# EasyEDA Pro project ProPrj_ESP32-S3.epro, board PCB1_1
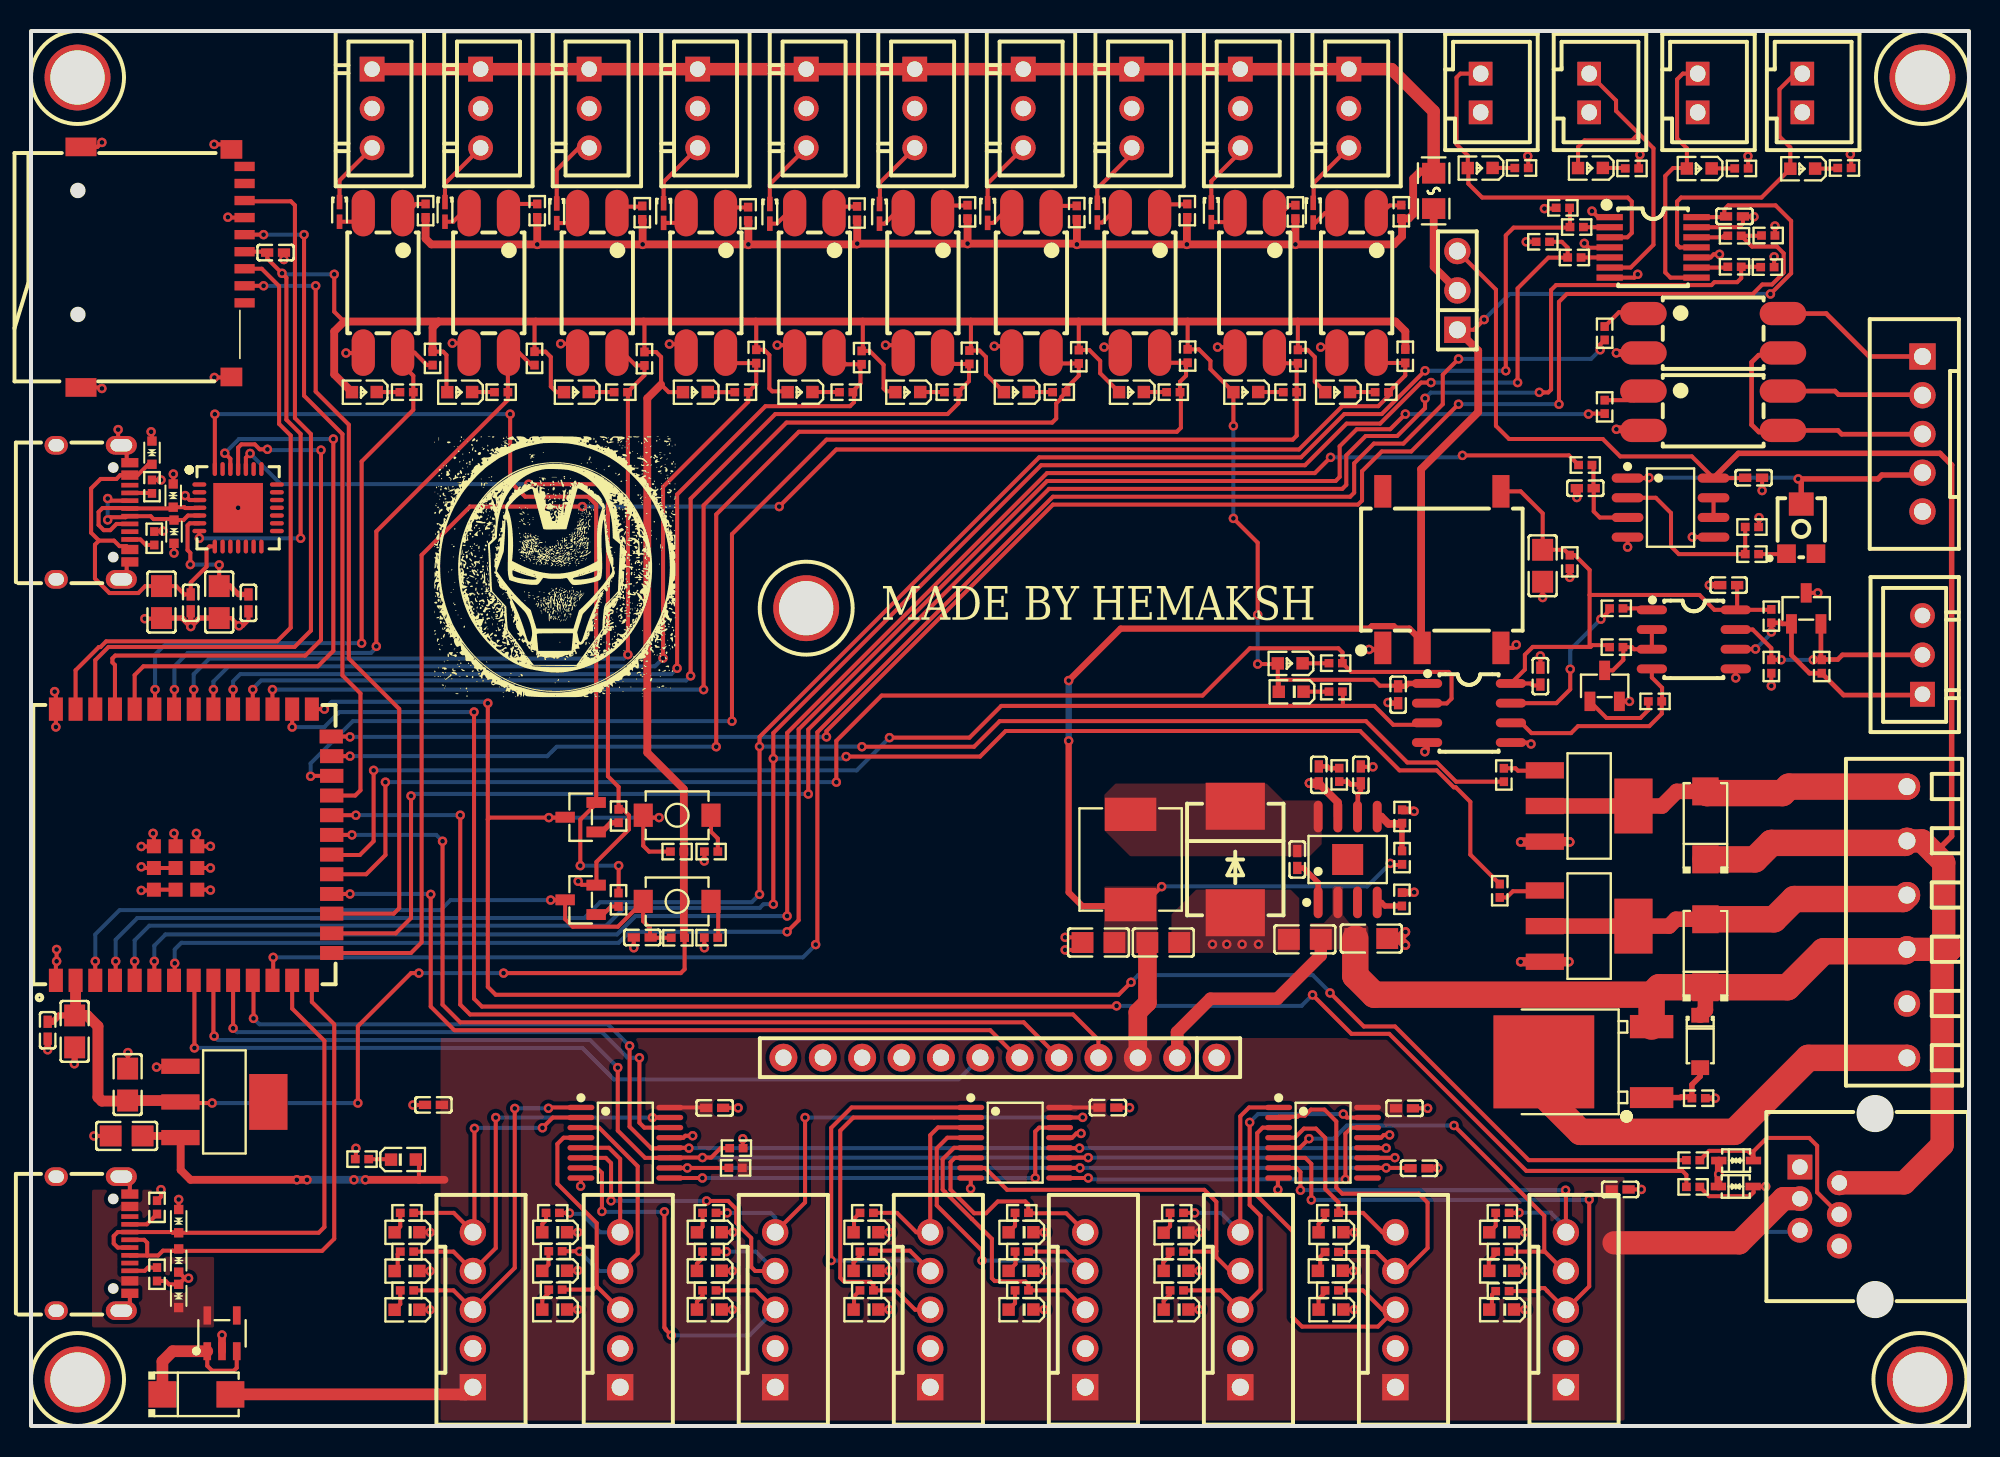
[diagram p3: board, top side]
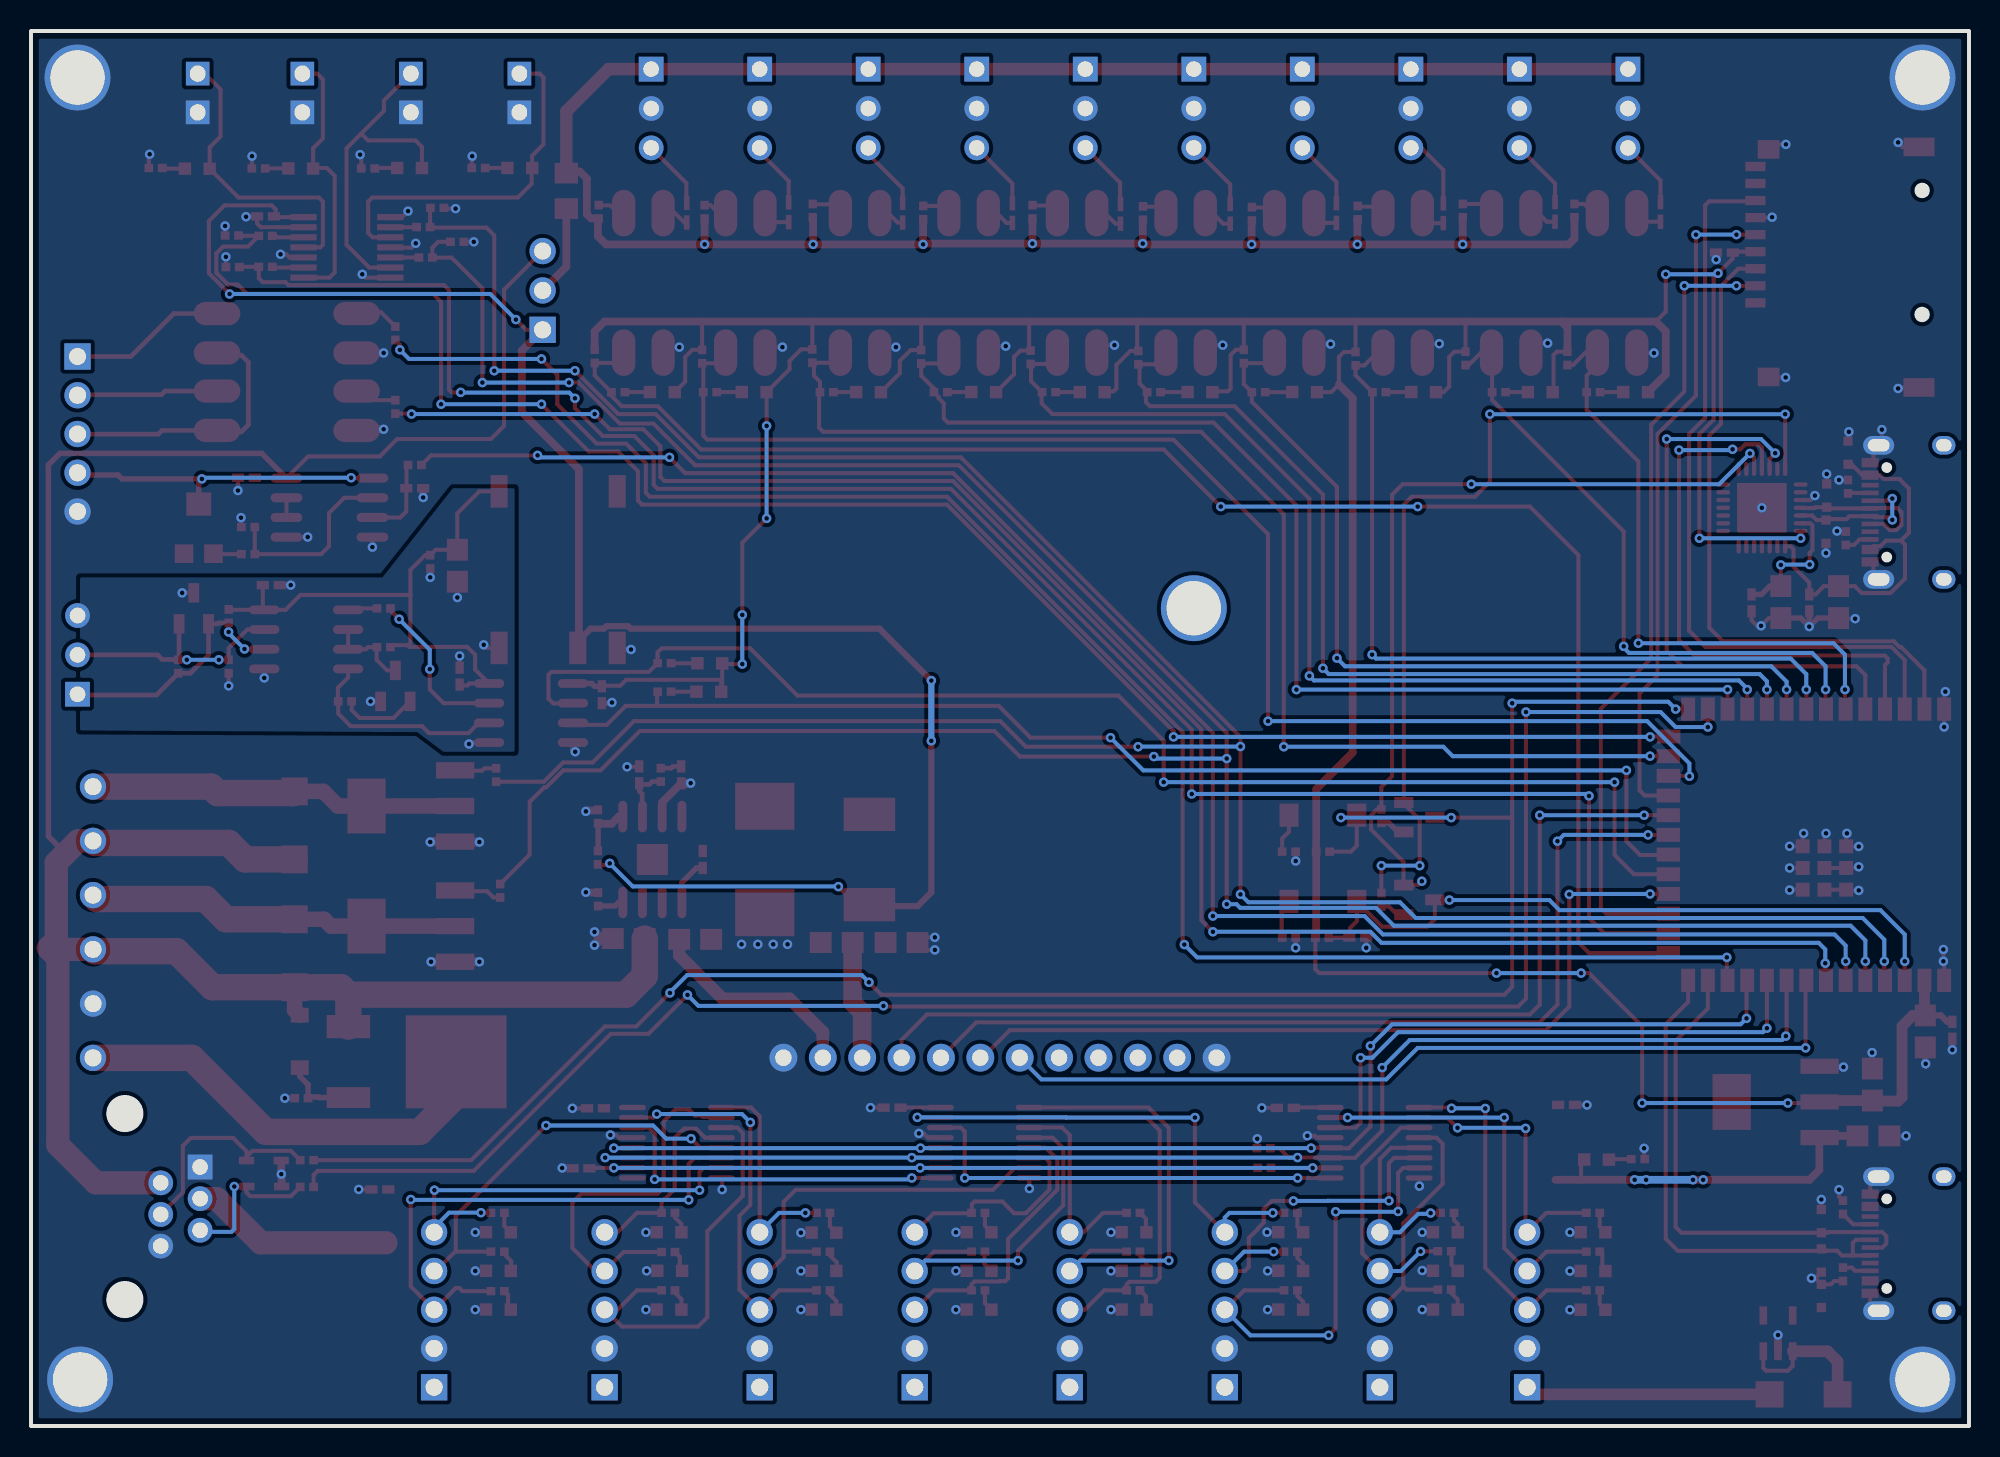
[diagram p4: board, bottom side, seen from below]

Outline 125 x 90 mm; copper layers: Top Layer, Bottom Layer. Coordinates in mm from the lower left corner of the outline.
Outline path: rectangle 0,90 125,0
Stack: Top Layer 0.035mm / Dielectric1 1.51mm FR4 er 4.5 / Bottom Layer 0.035mm

## Design rules (mm)
template: Custom Config
spacing copperThickness1oz (default): track to track 0.102, other pairs 0.152 to 0.3
spacing copperThickness2oz: track to track 0.203, other pairs 0.152 to 0.3
track width copperThickness1oz (default): min 0.127, default 0.254, max 2.54
track width copperThickness2oz: min 0.203, default 0.254, max 2.54
differential pair differentialPair (default): width min 0.127, default 0.254, max 2.54; gap min 0.152, default 0.152
via viaSize (default): diameter min 0.5, default 0.61, max 10; hole min 0.3, default 0.305, max 6.3
net +5V uses copperRegion1
net GND uses copperRegion1
net $1N95227 uses USB
pour e298 uses copperRegion1
pour e2802 uses copperRegion1
pour e2981 uses copperRegion1

## Placement (name value [footprint] x y rotation side)
C1  100nF  [C0402]  81.67 36.55 270 top
C2  2.2uF  [C0805]  86.45 31.45 180 top
C3  2.2uF  [C0805]  82.16 31.4 0 top
C4  47uF  [C0805]  68.85 31.19 0 top
C5  47uF  [C0805]  73.03 31.19 0 top
C6  39pF  [C0402]  85.77 42.01 270 top
C7  6.8nF  [C0402]  83.06 42.01 90 top
C9  10uF  [C0805]  97.5 55.5 90 top
C10  100nF  [C0402]  109.88 78.04 0 top
C11  10uF  [C0805]  6.23 22.03 270 top
C12  10uF  [C0805]  6.17 18.71 0 top
C13  100nF  [C0402]  109.5 54.25 180 top
C14  100nF  [C0402]  97.35 48.38 270 top
C15  100nF  [C0402]  88.18 47.18 90 top
C16  100nF  [C0402]  15.77 75.7 0 top
C17  10uF  [C0805]  2.82 25.46 90 top
C18  100nF  [C0402]  1.08 25.53 270 top
C19  220nF  [C0402]  39.42 31.52 0 top
C21  10uF  [C0805]  12.14 53.16 90 top
C22  100nF  [C0402]  14.02 53.1 270 top
C23  10uF  [C0805]  8.41 53.16 90 top
C24  100nF  [C0402]  10.3 53.1 270 top
C25  100nF  [C0402]  100.25 60.5 0 top
C26  100nF  [C0402]  111.11 61.18 180 top
C27  100nF  [C0402]  44.09 20.52 180 top
C28  100nF  [C0402]  69.46 20.54 180 top
C29  100nF  [C0402]  88.59 20.5 180 top
C30  100nF  [C0402]  89.53 16.62 180 top
C31  100nF  [C0402]  102.5 15.26 0 top
C32  100nF  [C0402]  25.95 20.72 180 top
D1  B560C-13-F  [SMC_L7.1-W6.2-LS8.1-RD]  77.67 36.55 270 top
D2  10V  [SOD-123_L2.8-W1.8-LS3.7-RD]  107.66 24.81 270 top
D3  B340A-13-F  [SMA_L4.4-W2.6-LS5.0-RD]  108 38.75 90 top
D4  B340A-13-F  [SMA_L4.4-W2.6-LS5.0-RD]  108 30.5 90 top
D5  PSM712-ES  [SOT-23-3_L2.9-W1.3-P1.90-LS2.4-BR]  114.5 52.75 270 top
D6  SD03C_C502532  [SOD-323_L1.8-W1.3-LS2.5-BI]  109.96 15.45 0 top
D7  SD03C_C502532  [SOD-323_L1.8-W1.3-LS2.5-BI]  109.98 17.13 0 top
D9  LESD5D5.0CT1G  [SOD-523_L1.2-W0.8-LS1.6-BI]  9.22 57.7 90 top
D10  LESD5D5.0CT1G  [SOD-523_L1.2-W0.8-LS1.6-BI]  9.17 60.03 270 top
D11  LESD5D5.0CT1G  [SOD-523_L1.2-W0.8-LS1.6-BI]  7.8 62.79 270 top
D12  RB521S-30  [SOD-523_L1.2-W0.8-LS1.6-RD]  19.9 78.33 270 top
D13  RB521S-30  [SOD-523_L1.2-W0.8-LS1.6-RD]  26.7 78.33 270 top
D14  RB521S-30  [SOD-523_L1.2-W0.8-LS1.6-RD]  33.91 78.24 270 top
D15  RB521S-30  [SOD-523_L1.2-W0.8-LS1.6-RD]  40.8 78.25 270 top
D16  RB521S-30  [SOD-523_L1.2-W0.8-LS1.6-RD]  47.65 78.2 270 top
D17  RB521S-30  [SOD-523_L1.2-W0.8-LS1.6-RD]  54.73 78.2 270 top
D18  RB521S-30  [SOD-523_L1.2-W0.8-LS1.6-RD]  61.7 78.25 270 top
D19  RB521S-30  [SOD-523_L1.2-W0.8-LS1.6-RD]  68.78 78.28 270 top
D20  RB521S-30  [SOD-523_L1.2-W0.8-LS1.6-RD]  76.13 78.3 270 top
D21  RB521S-30  [SOD-523_L1.2-W0.8-LS1.6-RD]  82.7 78.28 270 top
D22  LESD5D5.0CT1G  [SOD-523_L1.2-W0.8-LS1.6-BI]  9.53 8.39 270 top
D23  LESD5D5.0CT1G  [SOD-523_L1.2-W0.8-LS1.6-BI]  9.53 10.68 90 top
D24  LESD5D5.0CT1G  [SOD-523_L1.2-W0.8-LS1.6-BI]  9.53 13.22 270 top
D25  B340A-13-F  [SMA_L4.4-W2.6-LS5.0-RD]  10.67 2.04 0 top
H3  PZ254V-11-03P  [HDR-TH_3P-P2.54-V-M]  92 73.26 90 top
J1  ZX-XH2.54-2PZZ-R  [CONN-TH_XH2.54-2P]  93.5 86 270 top
J2  ZX-XH2.54-2PZZ-R  [CONN-TH_XH2.54-2P]  100.5 86 270 top
J3  ZX-XH2.54-2PZZ-R  [CONN-TH_XH2.54-2P]  114.25 86 270 top
J4  ZX-XH2.54-2PZZ-R  [CONN-TH_XH2.54-2P]  107.5 86 270 top
J5  ZX-XH2.54-3PZZ  [CONN-TH_3P-P2.54_2501S-3P]  122 49.75 90 top
J6  B5B-XH-A-M(LF)(SN)  [CONN-TH_5P-P2.50_JST_B5B-XH-A-M]  28.5 7.5 270 top
J7  B5B-XH-A-M(LF)(SN)  [CONN-TH_5P-P2.50_JST_B5B-XH-A-M]  122 64 90 top
J8  B5B-XH-A-M(LF)(SN)  [CONN-TH_5P-P2.50_JST_B5B-XH-A-M]  38 7.5 270 top
J9  ZX-XH2.54-3PZZ  [CONN-TH_3P-P2.54_2501S-3P]  22 85 270 top
J10  B5B-XH-A-M(LF)(SN)  [CONN-TH_5P-P2.50_JST_B5B-XH-A-M]  48 7.5 270 top
J11  ZX-XH2.54-3PZZ  [CONN-TH_3P-P2.54_2501S-3P]  29 85 270 top
J12  B5B-XH-A-M(LF)(SN)  [CONN-TH_5P-P2.50_JST_B5B-XH-A-M]  58 7.5 270 top
J13  ZX-XH2.54-3PZZ  [CONN-TH_3P-P2.54_2501S-3P]  36 85 270 top
J14  ZX-XH2.54-3PZZ  [CONN-TH_3P-P2.54_2501S-3P]  43 85 270 top
J15  B5B-XH-A-M(LF)(SN)  [CONN-TH_5P-P2.50_JST_B5B-XH-A-M]  68 7.5 270 top
J16  ZX-XH2.54-3PZZ  [CONN-TH_3P-P2.54_2501S-3P]  50 85 270 top
J17  B5B-XH-A-M(LF)(SN)  [CONN-TH_5P-P2.50_JST_B5B-XH-A-M]  78 7.5 270 top
J18  ZX-XH2.54-3PZZ  [CONN-TH_3P-P2.54_2501S-3P]  57 85 270 top
J19  ZX-XH2.54-3PZZ  [CONN-TH_3P-P2.54_2501S-3P]  64 85 270 top
J20  ZX-XH2.54-3PZZ  [CONN-TH_3P-P2.54_2501S-3P]  71 85 270 top
J21  ZX-XH2.54-3PZZ  [CONN-TH_3P-P2.54_2501S-3P]  78 85 270 top
J22  ZX-XH2.54-3PZZ  [CONN-TH_3P-P2.54_2501S-3P]  85 85 270 top
J23  B5B-XH-A-M(LF)(SN)  [CONN-TH_5P-P2.50_JST_B5B-XH-A-M]  88 7.5 270 top
J24  B5B-XH-A-M(LF)(SN)  [CONN-TH_5P-P2.50_JST_B5B-XH-A-M]  99 7.5 270 top
J67  2685Y-112CNG1SNA01  [HDR-TH_12P-P2.54-V-F]  62.5 23.76 180 top
L1  10uH  [IND-SMD_L7.1-W6.6]  70.92 36.55 270 top
LED2  XL-1608SURC-06  [LED0603-RD_RED]  81.22 49.2 180 top
LED8  XL-1608UGC-04  [LED0603-RD_GREEN]  24.25 12.5 180 top
LED9  XL-1608UGC-04  [LED0603-RD_GREEN]  24.25 10 180 top
LED10  XL-1608UGC-04  [LED0603-RD_GREEN]  24.25 7.5 180 top
LED11  XL-1608SURC-06  [LED0603-RD_RED]  21.5 66.7 180 top
LED12  XL-1608UGC-04  [LED0603-RD_GREEN]  33.78 12.5 180 top
LED13  XL-1608UGC-04  [LED0603-RD_GREEN]  33.78 10.01 180 top
LED14  XL-1608UGC-04  [LED0603-RD_GREEN]  33.78 7.51 180 top
LED15  XL-1608SURC-06  [LED0603-RD_RED]  27.65 66.7 180 top
LED16  XL-1608UGC-04  [LED0603-RD_GREEN]  43.75 12.5 180 top
LED17  XL-1608UGC-04  [LED0603-RD_GREEN]  43.75 10.01 180 top
LED18  XL-1608UGC-04  [LED0603-RD_GREEN]  43.75 7.51 180 top
LED19  XL-1608SURC-06  [LED0603-RD_RED]  35.18 66.7 180 top
LED20  XL-1608SURC-06  [LED0603-RD_RED]  42.85 66.7 180 top
LED21  XL-1608UGC-04  [LED0603-RD_GREEN]  53.85 12.5 180 top
LED22  XL-1608UGC-04  [LED0603-RD_GREEN]  53.85 10.01 180 top
LED23  XL-1608UGC-04  [LED0603-RD_GREEN]  53.85 7.51 180 top
LED24  XL-1608SURC-06  [LED0603-RD_RED]  49.6 66.7 180 top
LED25  XL-1608UGC-04  [LED0603-RD_GREEN]  63.85 12.5 180 top
LED26  XL-1608UGC-04  [LED0603-RD_GREEN]  63.85 10.01 180 top
LED27  XL-1608UGC-04  [LED0603-RD_GREEN]  63.85 7.51 180 top
LED28  XL-1608SURC-06  [LED0603-RD_RED]  56.55 66.7 180 top
LED29  XL-1608UGC-04  [LED0603-RD_GREEN]  73.85 12.48 180 top
LED30  XL-1608UGC-04  [LED0603-RD_GREEN]  73.85 10.01 180 top
LED31  XL-1608UGC-04  [LED0603-RD_GREEN]  73.85 7.51 180 top
LED32  XL-1608SURC-06  [LED0603-RD_RED]  63.55 66.7 180 top
LED33  XL-1608SURC-06  [LED0603-RD_RED]  70.98 66.7 180 top
LED34  XL-1608SURC-06  [LED0603-RD_RED]  78.35 66.7 180 top
LED35  XL-1608SURC-06  [LED0603-RD_RED]  84.28 66.7 180 top
LED36  XL-1608UGC-04  [LED0603-RD_GREEN]  83.85 12.5 180 top
LED37  XL-1608UGC-04  [LED0603-RD_GREEN]  83.8 10.01 180 top
LED38  XL-1608UGC-04  [LED0603-RD_GREEN]  83.85 7.51 180 top
LED39  XL-1608UGC-04  [LED0603-RD_GREEN]  94.85 12.5 180 top
LED40  XL-1608UGC-04  [LED0603-RD_GREEN]  94.85 10.01 180 top
LED41  XL-1608UGC-04  [LED0603-RD_GREEN]  94.85 7.51 180 top
LED42  XL-1608SURC-06  [LED0603-RD_RED]  100.58 81.16 180 top
LED43  XL-1608SURC-06  [LED0603-RD_RED]  107.6 81.13 180 top
LED44  XL-1608SURC-06  [LED0603-RD_RED]  114.28 81.12 180 top
LED45  XL-1608SURC-06  [LED0603-RD_RED]  93.47 81.16 180 top
LED46  XL-1608UGC-04  [LED0603-RD_GREEN]  81.28 47.37 180 top
LED47  XL-1608UGC-04  [LED0603-RD_GREEN]  24.02 17.19 0 top
MH1  Mounting Hole 3.5  [MOUNTING HOLE 3.5]  3 3 0 top
MH2  Mounting Hole 3.5  [MOUNTING HOLE 3.5]  121.84 3 0 top
MH3  Mounting Hole 3.5  [MOUNTING HOLE 3.5]  122 87 0 top
MH4  Mounting Hole 3.5  [MOUNTING HOLE 3.5]  3 87 0 top
MH5  Mounting Hole 3.5  [MOUNTING HOLE 3.5]  50 52.76 180 top
OPT1  TLP521GB-S  [OPTO-SMD-4_L6.5-W4.6-P2.54-LS10.0-TL]  108.5 65.5 0 top
OPT2  TLP521GB-S  [OPTO-SMD-4_L6.5-W4.6-P2.54-LS10.0-TL]  108.5 70.5 0 top
OPT3  TLP521GB-S  [OPTO-SMD-4_L6.5-W4.6-P2.54-LS10.0-TL]  22.7 73.75 270 top
OPT4  TLP521GB-S  [OPTO-SMD-4_L6.5-W4.6-P2.54-LS10.0-TL]  29.53 73.75 270 top
OPT5  TLP521GB-S  [OPTO-SMD-4_L6.5-W4.6-P2.54-LS10.0-TL]  36.53 73.75 270 top
OPT6  TLP521GB-S  [OPTO-SMD-4_L6.5-W4.6-P2.54-LS10.0-TL]  43.53 73.75 270 top
OPT7  TLP521GB-S  [OPTO-SMD-4_L6.5-W4.6-P2.54-LS10.0-TL]  50.53 73.75 270 top
OPT8  TLP521GB-S  [OPTO-SMD-4_L6.5-W4.6-P2.54-LS10.0-TL]  57.53 73.75 270 top
OPT9  TLP521GB-S  [OPTO-SMD-4_L6.5-W4.6-P2.54-LS10.0-TL]  64.53 73.75 270 top
OPT10  TLP521GB-S  [OPTO-SMD-4_L6.5-W4.6-P2.54-LS10.0-TL]  71.53 73.75 270 top
OPT11  TLP521GB-S  [OPTO-SMD-4_L6.5-W4.6-P2.54-LS10.0-TL]  78.93 73.75 270 top
OPT12  TLP521GB-S  [OPTO-SMD-4_L6.5-W4.6-P2.54-LS10.0-TL]  85.5 73.75 270 top
PS1  B0505XT-1WR3S  [PWRM-SMD_B0505XT-1WR3S]  91 55.25 0 top
PTC1  12V 500mA  [F0805]  90.47 79.69 90 top
Q1  AOD407  [TO-252-2_L6.5-W6.1-P4.58-LS10.0-TL]  101.05 23.48 180 top
Q2  NCE6005AR  [SOT-223_L6.5-W3.5-P2.30-LS7.0-BR]  100.5 40 180 top
Q3  NCE6005AR  [SOT-223_L6.5-W3.5-P2.30-LS7.0-BR]  100.5 32.25 180 top
Q4  BSS138  [SOT-23-3_L2.9-W1.3-P1.90-LS2.4-BR]  101.5 47.75 270 top
Q5  MMBT9014C  [SOT-23-3_L2.9-W1.3-P1.90-LS2.4-BR]  35.45 33.95 0 top
Q6  MMBT9014C  [SOT-23-3_L2.9-W1.3-P1.90-LS2.4-BR]  35.45 39.28 0 top
R1  10kΩ  [R0402]  21.35 17.22 0 top
R3  100kΩ  [R0402]  88.42 33.98 270 top
R4  13kΩ  [R0402]  84.38 42.01 270 top
R5  1kΩ  [R0402]  99.69 77.35 0 top
R6  1kΩ  [R0402]  109.88 76.79 0 top
R8  1kΩ  [R0402]  99.55 75.39 0 top
R9  1kΩ  [R0402]  109.88 74.79 0 top
R10  220Ω  [R0402]  99.25 55.75 90 top
R11  1kΩ  [R0402]  95 42 90 top
R12  10kΩ  [R0402]  107.56 21.15 180 top
R13  10kΩ  [R0402]  102.25 50.25 180 top
R15  402Ω  [R0402]  112.25 52.25 90 top
R16  1kΩ  [R0402]  94.74 34.53 270 top
R17  100Ω  [R0402]  102.25 52.75 0 top
R18  120Ω  [R0402]  115.5 49 90 top
R19  1kΩ  [R0402]  104.75 46.75 0 top
R20  402Ω  [R0402]  112.25 49 90 top
R26  120Ω  [R0402]  107.21 15.43 0 top
R27  120Ω  [R0402]  107.21 17.15 0 top
R28  10kΩ  [R0402]  37.89 33.95 270 top
R29  10kΩ  [R0402]  37.9 39.35 270 top
R30  10kΩ  [R0402]  41.72 31.5 0 top
R31  1kΩ  [R0402]  43.86 31.51 0 top
R32  10kΩ  [R0402]  41.67 37.06 0 top
R33  1kΩ  [R0402]  43.87 37.06 0 top
R34  5.1kΩ  [R0402]  7.95 57.27 270 top
R35  5.1kΩ  [R0402]  7.8 60.6 270 top
R36  10kΩ  [R0402]  24.25 13.75 0 top
R37  10kΩ  [R0402]  24.25 11.25 0 top
R38  10kΩ  [R0402]  24.25 8.75 0 top
R39  300Ω  [R0402]  101.5 65.75 90 top
R40  300Ω  [R0402]  101.5 70.5 90 top
R41  10kΩ  [R0402]  33.65 13.75 0 top
R42  10kΩ  [R0402]  33.83 11.28 0 top
R43  10kΩ  [R0402]  33.83 8.8 0 top
R44  10kΩ  [R0402]  24.23 66.7 180 top
R47  4.99kΩ  [R0402]  111 56.25 0 top
R48  10kΩ  [R0402]  100.25 62 0 top
R49  10kΩ  [R0402]  30.33 66.7 180 top
R50  10kΩ  [R0402]  32.48 68.88 90 top
R51  10kΩ  [R0402]  43.75 13.75 0 top
R52  10kΩ  [R0402]  43.75 11.25 0 top
R53  10kΩ  [R0402]  43.75 8.75 0 top
R54  10kΩ  [R0402]  111 58 180 top
R56  10kΩ  [R0402]  38.04 66.7 180 top
R57  10kΩ  [R0402]  39.57 68.86 90 top
R59  10kΩ  [R0402]  53.9 13.75 0 top
R60  10kΩ  [R0402]  53.9 11.25 0 top
R61  10kΩ  [R0402]  53.9 8.75 0 top
R62  10kΩ  [R0402]  45.83 66.7 180 top
R63  10kΩ  [R0402]  46.78 69 90 top
R65  10kΩ  [R0402]  52.58 66.7 180 top
R66  10kΩ  [R0402]  63.9 13.75 0 top
R67  10kΩ  [R0402]  63.9 11.25 0 top
R68  10kΩ  [R0402]  63.9 8.75 0 top
R69  10kΩ  [R0402]  53.58 68.93 90 top
R71  10kΩ  [R0402]  45.5 17.93 180 top
R72  10kΩ  [R0402]  59.35 66.7 180 top
R73  10kΩ  [R0402]  60.52 68.95 90 top
R75  10kΩ  [R0402]  73.9 13.75 0 top
R76  10kΩ  [R0402]  73.9 11.25 0 top
R77  10kΩ  [R0402]  73.9 8.75 0 top
R78  10kΩ  [R0402]  66.33 66.7 180 top
R79  10kΩ  [R0402]  67.58 68.98 90 top
R81  10kΩ  [R0402]  73.68 66.7 180 top
R82  10kΩ  [R0402]  74.6 69.03 90 top
R84  10kΩ  [R0402]  45.45 16.65 0 top
R85  680Ω  [R0402]  25.45 78.41 90 top
R86  680Ω  [R0402]  32.65 78.41 90 top
R87  680Ω  [R0402]  39.43 78.28 90 top
R88  680Ω  [R0402]  46.25 78.2 90 top
R89  680Ω  [R0402]  53.28 78.25 90 top
R90  680Ω  [R0402]  60.4 78.33 90 top
R91  680Ω  [R0402]  67.45 78.28 90 top
R92  680Ω  [R0402]  74.58 78.41 90 top
R93  10kΩ  [R0402]  81.71 69 90 top
R94  10kΩ  [R0402]  81.2 66.7 180 top
R95  10kΩ  [R0402]  88.64 69.02 90 top
R96  10kΩ  [R0402]  87.13 66.7 180 top
R97  680Ω  [R0402]  81.55 78.33 90 top
R98  680Ω  [R0402]  88.38 78.34 90 top
R99  10kΩ  [R0402]  83.9 13.75 0 top
R100  10kΩ  [R0402]  83.9 11.23 0 top
R101  10kΩ  [R0402]  83.9 8.75 0 top
R102  10kΩ  [R0402]  94.9 13.75 0 top
R103  10kΩ  [R0402]  94.9 11.25 0 top
R104  10kΩ  [R0402]  94.9 8.7 0 top
R105  5.1kΩ  [R0402]  8.13 9.79 90 top
R106  5.1kΩ  [R0402]  8.13 14.11 270 top
R107  10kΩ  [R0402]  25.9 68.88 90 top
R110  10kΩ  [R0402]  103.26 81.13 0 top
R111  10kΩ  [R0402]  110.32 81.13 0 top
R112  10kΩ  [R0402]  116.97 81.16 0 top
R113  10kΩ  [R0402]  96.14 81.16 0 top
R114  5.1kΩ  [R0402]  84.15 49.22 180 top
R115  5.1kΩ  [R0402]  84.15 47.38 180 top
R116  10kΩ  [R0402]  112.05 76.81 180 top
R117  10kΩ  [R0402]  112 74.77 180 top
R118  10kΩ  [R0402]  97.51 76.4 0 top
R119  10kΩ  [R0402]  98.8 78.59 0 top
R120  10kΩ  [R0402]  88.44 39.32 270 top
R121  53.6kΩ  [R0402]  88.44 36.67 270 top
RJ1  RJ1  [RJ11-TH_PCB-6P6C-90]  115.36 14.16 90 top
SD1  TF-01A  [TF-SMD_TF-01A]  8.5 74.76 270 top
SW1  SKRKAEE020  [KEY-SMD_L3.9-W3.0-LS5.0]  41.67 33.84 180 top
SW2  SKRKAEE020  [KEY-SMD_L3.9-W3.0-LS5.0]  41.67 39.4 180 top
TB1  DB125-3.5-6P-GN-S  [CONN-TH_6P-P3.50_DB125-3.5-6P-GN-S]  121 32.5 90 top
U1  TPS54360DDAR  [SOIC-8_L5.0-W4.0-P1.27-LS6.0-BL-EP2.0]  84.92 36.55 0 top
U2  74AHCT125T14-13  [TSSOP-14_L5.0-W4.4-P0.65-LS6.4-BL]  104.62 76.04 270 top
U3  AMS1117-3.3_C369933  [SOT-223-4_L6.5-W3.5-P2.30-LS7.0-BR]  12.47 20.91 180 top
U4  ADUM3201ARZ-RL7  [SOIC-8_L5.0-W4.0-P1.27-LS6.0-BL]  92.75 46 270 top
U5  SN65HVD3082EDR  [SOIC-8_L5.0-W4.0-P1.27-LS6.0-BL]  107.25 50.75 270 top
U7  CP2102-GMR  [WQFN-28_L5.0-W5.0-P0.50-BL-EP3.2]  13.36 59.24 270 top
U8  LM358ADT  [SOIC-8_L4.9-W3.9-P1.27-LS6.0-BL]  105.75 59.25 270 top
U9  74AHCT595T16-13  [TSSOP-16_L5.0-W4.4-P0.65-LS6.4-BL]  38.34 18.28 270 top
U10  74AHCT595T16-13  [TSSOP-16_L5.0-W4.4-P0.65-LS6.4-BL]  63.48 18.28 270 top
U11  74AHCT595T16-13  [TSSOP-16_L5.0-W4.4-P0.65-LS6.4-BL]  83.34 18.28 270 top
U13  MIC2005A-1YM5-TR  [SOT-23-5_L3.0-W1.7-P0.95-LS2.8-BL]  12.32 5.98 0 top
U14  ESP32-S3-WROOM-1U-N8R8  [WIRELM-SMD_ESP32-S3-WROOM-1U]  10.5 37.5 90 top
USB1  TYPE-C 16PIN 2MD(073)  [USB-C-SMD_TYPE-C-6PIN-2MD-073]  4 58.95 270 top
USB2  TYPE-C 16PIN 2MD(073)  [USB-C-SMD_TYPE-C-6PIN-2MD-073]  4 11.76 270 top
VR1  20kΩ  [RES-ADJ-SMD_TC33X-2-104E]  114.18 57.88 0 top

## Footprints (pads in the part's own frame, mm; a bottom-side part is the same pattern mirrored in y, then rotated)
C0402
  rect 0.79x0.54 smd: 1(-0.545,0) 2(0.545,0)
C0805
  rect 1.41x1.35 smd: 1(-1.03,0) 2(1.03,0)
CONN-TH_3P-P2.54_2501S-3P
  rect 1.6x1.6 hole 1: 1(-2.54,0)
  round 1.6 hole 1: 2(0,0) 3(2.54,0)
CONN-TH_5P-P2.50_JST_B5B-XH-A-M
  rect 1.7x1.7 hole 1.1: 1(5,0)
  round 1.7 hole 1.1: 2(2.5,0) 3(0,0) 4(-2.5,0) 5(-5,0)
CONN-TH_6P-P3.50_DB125-3.5-6P-GN-S
  round 1.7 hole 1.1: 1(-8.75,0) 2(-5.25,0) 3(-1.75,0) 4(1.75,0) 5(5.25,0) 6(8.75,0)
CONN-TH_XH2.54-2P
  rect 1.524x1.524 hole 1.05x1: 1(-1.25,0) 2(1.25,0)
F0805
  rect 1.335x1.5 smd: 1(-1.143,0) 2(1.143,0)
HDR-TH_3P-P2.54-V-M
  rect 1.7x1.7 hole 1.1: 1(-2.54,0)
  round 1.7 hole 1.1: 2(0,0) 3(2.54,0)
HDR-TH_12P-P2.54-V-F
  round 1.8 hole 1.05: 1(-13.97,0) 2(-11.43,0) 3(-8.89,0) 4(-6.35,0) 5(-3.81,0) 6(-1.27,0) 7(1.27,0) 8(3.81,0) 9(6.35,0) 10(8.89,0) 11(11.43,0) 12(13.97,0)
IND-SMD_L7.1-W6.6
  rect 2.15x3.32 smd: 1(-2.913,0) 2(2.913,0)
KEY-SMD_L3.9-W3.0-LS5.0
  rect 1.23x1.5 smd: 1(-2.185,0) 2(2.185,0)
LED0603-RD_GREEN
  rect 0.8x0.8 smd: 1(-0.799,-0.004) 2(0.799,0.004)
LED0603-RD_RED
  rect 0.8x0.8 smd: 1(-0.799,-0.004) 2(0.799,0.004)
MOUNTING HOLE 3.5
  round 4.25 hole 3.5: 1(0,0)
OPTO-SMD-4_L6.5-W4.6-P2.54-LS10.0-TL
  oval 3x1.5 smd: 1(-4.5,1.27) 2(-4.5,-1.27) 3(4.5,-1.27) 4(4.5,1.27)
PWRM-SMD_B0505XT-1WR3S
  rect 1.1x2.1 smd: 1(-3.81,-5.05) 2(-1.27,-5.05) 4(3.81,-5.05) 5(3.81,5.05) 8(-3.81,5.05)
R0402
  rect 0.566x0.54 smd: 1(-0.432,0) 2(0.433,0)
RES-ADJ-SMD_TC33X-2-104E
  rect 1.2x1.2 smd: 1(-0.95,-1.6) 3(0.95,-1.6)
  rect 1.6x1.5 smd: 2(0,1.6)
RJ11-TH_PCB-6P6C-90
  rect 1.6x1.6 hole 1: 1(2.55,1.27)
  round 1.6 hole 1: 2(1.53,-1.27) 3(0.51,1.27) 4(-0.51,-1.27) 5(-1.53,1.27) 6(-2.55,-1.27)
SMA_L4.4-W2.6-LS5.0-RD
  rect 1.8x1.7 smd: 1(-2.192,0) 2(2.192,0)
SMC_L7.1-W6.2-LS8.1-RD
  rect 3.03x3.82 smd: 1(-3.435,0) 2(3.435,0)
SOD-123_L2.8-W1.8-LS3.7-RD
  rect 0.95x1.15 smd: 1(-1.692,0) 2(1.692,0)
SOD-323_L1.8-W1.3-LS2.5-BI
  rect 0.985x0.49 smd: 1(-1.117,0) 2(1.117,0)
SOD-523_L1.2-W0.8-LS1.6-BI
  rect 0.6x0.6 smd: 1(-0.75,0) 2(0.75,0)
SOD-523_L1.2-W0.8-LS1.6-RD
  rect 0.93x0.36 smd: 1(-0.635,0) 2(0.635,0)
SOIC-8_L4.9-W3.9-P1.27-LS6.0-BL
  oval 0.588x2.045 smd: 1(-1.905,-2.772) 2(-0.635,-2.772) 3(0.635,-2.772) 4(1.905,-2.772) 5(1.905,2.772) 6(0.635,2.772) 7(-0.635,2.772) 8(-1.905,2.772)
SOIC-8_L5.0-W4.0-P1.27-LS6.0-BL
  oval 0.569x1.95 smd: 1(-1.905,-2.705) 2(-0.635,-2.705) 3(0.635,-2.705) 4(1.905,-2.705) 5(1.905,2.705) 6(0.635,2.705) 7(-0.635,2.705) 8(-1.905,2.705)
SOIC-8_L5.0-W4.0-P1.27-LS6.0-BL-EP2.0
  oval 0.574x2.038 smd: 1(-1.905,-2.769) 2(-0.635,-2.769) 3(0.635,-2.769) 4(1.905,-2.769) 5(1.905,2.769) 6(0.635,2.769) 7(-0.635,2.769) 8(-1.905,2.769)
  rect 2x2 smd: 9(0,0)
SOT-23-3_L2.9-W1.3-P1.90-LS2.4-BR
  rect 1.25x0.7 smd: 1(1,-0.95) 2(1,0.95) 3(-1,0)
SOT-23-5_L3.0-W1.7-P0.95-LS2.8-BL
  rect 0.49x1.157 smd: 1(-0.95,-1.153) 2(0,-1.153) 3(0.95,-1.153)
  rect 0.49x1.175 smd: 4(0.95,1.153) 5(-0.95,1.153)
SOT-223-4_L6.5-W3.5-P2.30-LS7.0-BR
  rect 2.47x0.98 smd: 1(2.835,-2.3) 2(2.835,0) 3(2.835,2.3)
  rect 2.47x3.6 smd: 4(-2.835,0)
SOT-223_L6.5-W3.5-P2.30-LS7.0-BR
  rect 2.465x1.05 smd: 1(2.857,-2.3) 2(2.857,0) 3(2.857,2.3)
  rect 2.465x3.54 smd: 4(-2.857,0)
TF-SMD_TF-01A
  rect 0.6x1.3 smd: 1(2.3,5.276) 2(1.2,5.276) 3(0.101,5.276) 4(-1,5.276) 5(-2.099,5.276) 6(-3.2,5.276) 7(-4.3,5.276) 8(-5.399,5.276) 9(-6.5,5.276)
  rect 1.2x1.4 smd: 10(-7.599,4.426) 13(7.08,4.426)
  rect 1.2x2 smd: 11(-7.76,-5.276) 12(7.76,-5.276)
TO-252-2_L6.5-W6.1-P4.58-LS10.0-TL
  rect 2.8x1.35 smd: 1(-3.475,2.29)
  rect 2.8x1.5 smd: 3(-3.475,-2.29)
  rect 6.5x6 smd: 4(3.475,-0.017)
TSSOP-14_L5.0-W4.4-P0.65-LS6.4-BL
  rect 0.4x1.7 smd: 1(-1.95,-2.8) 2(-1.3,-2.8) 3(-0.65,-2.8) 4(0,-2.8) 5(0.65,-2.8) 6(1.3,-2.8) 7(1.95,-2.8) 8(1.95,2.8) 9(1.3,2.8) 10(0.65,2.8) 11(0,2.8) 12(-0.65,2.8) 13(-1.3,2.8) 14(-1.95,2.8)
TSSOP-16_L5.0-W4.4-P0.65-LS6.4-BL
  oval 0.343x1.732 smd: 1(-2.275,-2.865) 2(-1.625,-2.865) 3(-0.975,-2.865) 4(-0.325,-2.865) 5(0.325,-2.865) 6(0.975,-2.865) 7(1.625,-2.865) 8(2.275,-2.865) 9(2.275,2.866) 10(1.625,2.866) 11(0.975,2.866) 12(0.325,2.866) 13(-0.325,2.866) 14(-0.975,2.866) 15(-1.625,2.866) 16(-2.275,2.866)
USB-C-SMD_TYPE-C-6PIN-2MD-073
  rect 0.6x1.1 smd: 1(-3.2,2.375) 2(-2.4,2.375) 11(2.4,2.375) 12(3.2,2.375)
  rect 0.3x1.1 smd: 3(-1.75,2.375) 4(-1.25,2.375) 5(-0.75,2.375) 6(-0.25,2.375) 7(0.25,2.375) 8(0.75,2.375) 9(1.25,2.375) 10(1.75,2.375)
  oval 1.2x2 hole 0.8x1.4: 13(-4.325,1.825) 14(4.325,1.825)
  oval 1.2x1.5 hole 0.8x1: 15(-4.325,-2.375) 16(4.325,-2.375)
WIRELM-SMD_ESP32-S3-WROOM-1U
  rect 1.5x0.9 smd: 1(-8.75,8.895) 2(-8.75,7.625) 3(-8.75,6.355) 4(-8.75,5.085) 5(-8.75,3.815) 6(-8.75,2.545) 7(-8.75,1.275) 8(-8.75,0.005) 9(-8.75,-1.265) 10(-8.75,-2.535) 11(-8.75,-3.805) 12(-8.75,-5.075) 13(-8.75,-6.345) 14(-8.75,-7.615) 27(8.75,-7.615) 28(8.75,-6.345) 29(8.75,-5.075) 30(8.75,-3.805) 31(8.75,-2.535) 32(8.75,-1.265) 33(8.75,0.005) 34(8.75,1.275) 35(8.75,2.545) 36(8.75,3.815) 37(8.75,5.085) 38(8.75,6.355) 39(8.75,7.625) 40(8.75,8.895)
  rect 0.9x1.5 smd: 15(-6.985,-8.895) 16(-5.715,-8.895) 17(-4.445,-8.895) 18(-3.175,-8.895) 19(-1.905,-8.895) 20(-0.635,-8.895) 21(0.635,-8.895) 22(1.905,-8.895) 23(3.175,-8.895) 24(4.445,-8.895) 25(5.715,-8.895) 26(6.985,-8.865)
  rect 0.9x0.9 smd: 41(-2.9,2.575) 41(-2.9,1.175) 41(-2.9,-0.225) 41(-1.5,2.575) 41(-1.5,1.175) 41(-1.5,-0.225) 41(-0.1,2.575) 41(-0.1,1.175) 41(-0.1,-0.225)
WQFN-28_L5.0-W5.0-P0.50-BL-EP3.2
  oval 0.28x0.9 smd: 1(-1.502,-2.5) 2(-1.001,-2.5) 3(-0.5,-2.5) 4(0,-2.5) 5(0.5,-2.5) 6(1,-2.5) 7(1.501,-2.5) 15(1.501,2.5) 16(1,2.5) 17(0.5,2.5) 18(0,2.5) 19(-0.5,2.5) 20(-1.001,2.5) 21(-1.502,2.5)
  oval 0.9x0.28 smd: 8(2.5,-1.502) 9(2.5,-1.001) 10(2.5,-0.5) 11(2.5,0) 12(2.5,0.5) 13(2.5,1) 14(2.5,1.501) 22(-2.5,1.501) 23(-2.5,1) 24(-2.5,0.5) 25(-2.5,0) 26(-2.5,-0.5) 27(-2.5,-1.001) 28(-2.5,-1.502)
  rect 3.2x3.2 smd: 29(0,0)

## Nets
As in the schematic.

Pads without a net: J67 8 9 10 11; MH5 1; PS1 8; SD1 1 8 9; U1 3; U3 4; U7 1 2 9 10 11 12 13 14 15 16 17 18 19 20 21 22 23 27; U11 9; U13 4; USB1 3 9 15 16; USB2 3 9 15 16; VR1 3

## Via types
v1: diameter 0.61, hole 0.305, Top Layer to Bottom Layer, 322 vias

## Routing (per net, layer and track width the routed paths; a pad name or vN(x,y) marks a point on that pad's centre or on a via; arc(x,y) is an arc through that point)
+3V3: length 290
  Top Layer w0.26: 60.62,71.26 60.62,69.48 R73.2 61.18,69.38 61.59,68.97 61.59,67.86 LED32.2 ; 53.65,71.26 53.65,69.44 R69.2 54.09,69.36 54.99,68.46 54.99,66.94 55.18,66.75 55.7,66.75 LED28.2 ; v1(17.39,57.27) 17.39,64.01 16.47,64.92 16.47,74.09 v1(16.19,74.37) 15.24,75.32 15.24,75.69 C16.1 ; v1(25.02,29.22) 24.51,29.22 21.08,25.79 v1(21.08,20.84) ; 10.86,57.74 v1(10.86,57.27) ; v1(30.48,29.22) 41.91,29.22 42.16,29.47 R30.2 ; LED20.2 41.13,66.7 40.64,67.19 40.64,68.97 40.32,69.29 39.57,69.29 39.57,71.2 39.51,71.26 ; LED24.2 48.75,66.75 47.81,66.75 47.62,66.94 47.62,69.1 47.28,69.44 R63.2 46.78,71.23 46.75,71.26 ; v1(77.55,58.56) 79.12,56.99 v1(79.12,52.33) ; v1(77.55,64.52) LED34.2 76.07,68.18 76.07,68.72 75.33,69.46 R82.2 74.6,71.24 74.62,71.26 ; 32.55,71.26 32.48,71.18 R50.2 33.19,69.31 33.53,68.97 33.53,67.06 33.89,66.7 34.38,66.7 ; 67.57,71.26 67.58,71.24 R79.2 68.26,69.42 68.96,68.72 68.96,67.92 LED33.2 ; SD1.4 15.23,75.76 ; LED15.2 26.8,66.75 26.8,69.1 26.58,69.31 R107.2 ; 81.71,71.25 R93.2 82.34,69.43 82.8,68.97 82.8,67.38 LED35.2 ; v1(11.68,20.84) 9.71,20.84 ; C15.2 88.14,47.76 87,47.76 86.61,48.14 80.48,48.14 80.48,47.38 80.42,47.44 LED2.2 80.37,49.16 v1(79.12,49.16) ; 20.19,71.26 19.56,71.89 v1(19.56,74.3)
  Top Layer w0.35: U4.1 88.83,47.91 88.65,47.72 C15.2
  Top Layer w0.4: C18.1 1.41,26.08 1.81,26.49 C17.2
  Top Layer w0.5: R107.2 25.9,70.87 26.29,71.26 ; 20.7,66.7 19.56,67.84 19.56,70.62 20.19,71.26 26.29,71.26 ; 26.29,71.26 88.01,71.26 88.65,70.62 88.65,69.46 R95.2 ; 40.64,67.19 39.75,66.3 39.75,43.44 42.11,41.09 R32.2 42.11,31.55 R30.2
  Top Layer w0.7: U3.2 9.55,21 C11.2 6.2,20.96 4.57,20.96 4.32,21.22 4.32,25.79 3.62,26.49 C17.2 2.88,26.55 U14.2
  Bottom Layer w0.26: v1(19.56,74.3) 16.26,74.3 v1(16.19,74.37) ; v1(30.48,29.22) v1(25.02,29.22) ; v1(77.55,64.52) v1(77.55,58.56) ; v1(21.08,20.84) v1(11.68,20.84) ; v1(10.86,57.27) v1(17.39,57.27) ; v1(79.12,52.33) v1(79.12,49.16)
+5V: length 182.4
  Top Layer w0.26: U10.16 68.91,20.55 C28.2 ; v1(112.19,73.03) 113.53,74.37 113.53,77.74 112.52,78.75 109.47,78.75 109.22,78.49 109.22,78.15 C10.1 109.28,77.99 U2.14 ; v1(93.73,71.38) 93.07,70.72 H3.1 ; 89.66,50.81 89.73,50.74 PS1.2 ; C27.2 43.52,20.55 41.2,20.55 ; 25.02,15.88 25.02,17.03 24.83,17.22 ; 88.42,36.2 87.78,36.2 v1(87.67,36.3) ; v1(72.92,34.8) 71.76,33.64 L1.2
  Top Layer w0.4: v1(66.93,48.09) 70.28,51.44 86.34,51.44 86.49,51.6 87.89,51.6 88.04,51.44 88.9,51.44 89.53,50.81 89.66,50.81 ; v1(66.93,44.2) 66.93,34.43 67.82,33.54 70.83,33.54 L1.2
  Top Layer w0.5: 26.67,15.88 v1(21.57,15.88) ; v1(17.8,15.88) v1(17.14,15.88) 10.29,15.88 9.65,16.52 9.65,18.59 U3.3 9.53,18.71 C12.2 ; 89.66,50.81 89.66,61.73 93.34,65.41 93.34,69.38 H3.1
  Top Layer w0.75: J6.1 28.04,2.04 D25.2
  Top Layer w1.2: C5.1 72.01,31.19 72.01,27.31 71.39,26.69 J67.3
  Top Layer w1.5: RJ1.3 113.03,14.67 110.18,11.82 102.11,11.82
  Bottom Layer w0.26: v1(72.92,34.8) 72.94,34.81 86.19,34.81 v1(87.67,36.3) ; v1(112.19,73.03) 95.38,73.03 v1(93.73,71.38)
  Bottom Layer w0.4: v1(66.93,48.09) v1(66.93,44.2)
  Bottom Layer w0.5: v1(17.8,15.88) v1(20.83,15.88) v1(21.57,15.88)
+5V_ISO: length 37.8
  Top Layer w0.26: 112.25,52.68 112.22,52.66 U5.8 ; U5.8 108.58,52.66 107.62,53.62 100.53,53.62 ; U5.8 110.04,52.75 C13.1 ; 100.53,53.62 100.53,50.38 ; 100.53,53.62 100.53,55.23 99.57,56.18 99.25,56.18 98.9,56.53 C9.2 97.5,56.53 97.5,58.88 96.08,60.3 PS1.5 ; R13.2 101.69,50.38 100.71,50.38 100.59,50.26 96.86,50.26 96.35,49.76 96.35,48.81 U4.8 96.73,47.91 96.85,47.78 97.3,47.78 97.35,47.83
+12V: length 175.1
  Top Layer w0.26: 122.77,36.94 122.63,36.8 ; H3.3 94.49,73.31 94.49,64.52 95.33,63.68 101.38,63.68 102.5,62.55 107.12,62.55 U8.8 110.54,61.16 C26.2
  Top Layer w0.35: 122.77,36.94 123.88,38.05 123.88,62 123.13,62.75 110.12,62.75 U8.8
  Top Layer w0.8: C3.2 83.19,30.37 80.39,27.57 76.07,27.57 73.91,25.41 73.91,25.15 73.93,25.13 J67.2
  Top Layer w1: D4.1 108,26.84 107.66,26.5
  Top Layer w1.5: 123.8,30.75 123.88,30.83 123.37,31.34 123.37,36.34 121.96,37.75 TB1.5 ; 123.8,30.75 TB1.3 ; 123.8,30.75 123.27,30.22 123.27,18.14 120.82,15.69 RJ1.2
  Top Layer w1.7: 104.53,27.82 Q1.3 ; 104.53,27.82 86.63,27.82 85.42,29.04 C2.2 ; 104.53,27.82 105.01,28.31 D4.1 113.29,28.31 115.62,30.63 120.88,30.63 TB1.3 ; TB1.5 120.87,37.62 112.25,37.62 111.19,36.56 D3.1
GND: length 141.6
  Top Layer w0.26: v1(117.35,82.05) 117.4,82 R112.2 ; v1(6.25,24.09) 6.25,23.08 C11.1 ; v1(100.19,76.3) 100.47,76.02 101.8,76.02 U2.4 ; C21.1 12.91,52.13 v1(13.41,51.63) 13.67,51.63 14.02,51.98 C22.2 ; R33.1 43.43,36.46 v1(43.43,36.45) ; U9.8 35.47,15.49 v1(35.45,15.48) ; v1(25.74,10) 25.73,10 LED9.1 ; U11.8 80.42,15.95 v1(80.42,15.25) ; 6.17,62.15 6.17,62.72 5.62,63.27 v1(5.62,64.28) ; 12.93,82.36 12.6,82.69 v1(11.81,82.69) ; v1(55.12,69.73) 55.78,69.73 OPT8.3 ; v1(66.7,30.72) 67.34,30.72 C4.1 67.49,31.53 v1(66.7,31.53) ; v1(4.57,66.94) 4.51,67 SD1.12 ; v1(12.7,77.99) 12.72,77.96 SD1.6 ; LED23.1 55.34,7.51 v1(55.34,7.51) ; v1(67.73,18.88) 67.43,18.88 67.15,18.6 U10.13 ; v1(76.53,69.6) 77.3,69.6 OPT11.3 ; v1(69.22,69.6) 69.9,69.6 OPT10.3 ; LED12.1 35.26,12.5 v1(35.27,12.5) ; v1(25.74,7.49) 25.73,7.5 LED10.1 ; USB2.12 6.38,7.99 5.83,7.44 ; v1(103.77,82.02) 103.7,81.94 R110.2 ; v1(75.34,10.01) 75.34,10.01 LED30.1 ; U14.41 U14.41 7.88,34.55 v1(7.11,34.55) ; v1(55.34,10.01) 55.34,10.01 LED22.1 ; USB2.13 6.38,15.54 USB2.1 ; LED26.1 65.34,10.01 v1(65.34,10.01) ; C32.2 25.4,20.71 v1(24.64,20.71) ; 5.62,54.62 6.17,55.17 6.17,55.75 ; U2.10 108.33,75.39 108.53,75.59 v1(108.91,75.59) ; U2.1 101.07,77.99 v1(100.68,78.38) ; 8.13,9.35 8.69,9.35 8.9,9.14 D22.1 9.92,9.53 ; v1(87.63,18.78) 87.25,18.78 87.08,18.6 86.21,18.6 ; R118.1 v1(96.44,76.4) ; R1.1 20.95,17.26 v1(20.95,17.92) ; LED39.1 96.34,12.5 v1(96.34,12.5) ; R34.1 7.98,57.74 v1(8.51,57.74) ; v1(1.61,45.1) U14.40 1.61,47.3 v1(1.52,47.38) ; v1(62.13,69.67) 62.84,69.67 OPT9.3 ; OPT7.3 48.78,69.73 v1(48.13,69.73) ; LED41.1 96.34,7.51 v1(96.34,7.51) ; v1(111.66,60.35) 111.66,61.17 C26.1 ; v1(83.19,69.6) 83.88,69.6 OPT12.3 ; v1(75.34,7.51) 75.33,7.51 LED31.1 ; v1(41.18,69.8) 41.7,69.8 OPT6.3 ; v1(90.74,16.65) 90.72,16.62 C30.1 ; v1(65.34,7.51) 65.34,7.51 LED27.1 ; v1(97.62,78.54) 98.32,78.54 R119.1 ; D9.1 v1(9.22,56.32) ; LED25.1 65.34,12.5 v1(65.34,12.5) ; v1(34.17,69.82) 34.68,69.82 OPT5.3 ; LED17.1 45.23,10.01 v1(45.24,10.01) ; U8.5 108.51,57.35 v1(107.16,57.35) ; C23.1 8.37,52.08 v1(7.34,52.08) ; C28.1 70.85,20.54 ; v1(45.91,18.53) 45.91,17.95 R71.1 ; v1(96.34,10.01) 96.34,10.01 LED40.1 ; U14.41 11.55,34.6 v1(11.57,34.57) ; C31.2 v1(103.86,15.26) ; R54.1 111.46,58.02 v1(111.46,58.6) ; v1(11.83,67.65) 12.89,67.65 SD1.13 ; v1(7.11,36.08) 7.19,36 U14.41 U14.41 ; v1(35.27,7.51) 35.26,7.51 LED14.1 ; v1(8.38,15.25) 8.38,14.79 R106.1 ; C16.2 16.31,75.69 v1(16.31,75.26) ; D11.1 7.8,64.09 v1(7.75,64.14) ; v1(42.68,18.73) 42.2,18.73 42.08,18.6 41.2,18.6 ; v1(45.24,7.51) 45.23,7.51 LED18.1 ; v1(7.11,37.39) 7.91,37.39 U14.41 7.92,38.18 v1(7.87,38.24) ; v1(38.88,30.85) 38.88,31.45 38.83,31.5 ; LED36.1 85.33,12.5 v1(85.34,12.5) ; D10.1 9.18,60.78 v1(9.18,61.42) ; v1(75.34,12.47) 75.34,12.48 LED29.1 ; v1(20.32,69.22) 21.4,69.22 OPT3.3 ; R117.1 v1(112.43,75.43) ; LED21.1 55.34,12.5 v1(55.34,12.5) ; v1(43.43,30.85) 43.43,30.86 R31.1 ; v1(110.74,81.92) 110.76,81.91 R111.2 ; v1(1.65,30.74) v1(1.65,29.98) 1.61,29.93 U14.1 ; v1(4.57,82.81) 4.28,82.52 SD1.11 ; v1(103.63,74.3) 103.42,74.09 U2.7 ; C27.1 v1(45.61,20.52) ; C29.1 v1(90.08,20.5) ; R113.2 96.57,81.89 v1(96.54,81.92) ; v1(60.6,15.32) 60.61,15.33 U10.8 ; C12.1 v1(4.06,18.71) ; v1(9.22,38.24) 9.33,38.13 U14.41 ; 9.92,9.53 D23.1 ; 9.92,9.53 v1(10.16,9.53) ; v1(86.55,42.53) 85.8,42.53 C6.1 ; v1(102.98,56.7) 102.98,57.34 U8.4 ; U2.13 109.04,77.34 109.04,77.34 110.18,77.34 110.42,77.58 C10.2 111.11,78.04 v1(111.13,78.02) ; v1(8.1,23.15) 8.15,23.21 U3.1 ; LED13.1 35.25,10.01 v1(35.27,10.03) ; D24.1 v1(9.53,14.61) ; LED37.1 85.29,10.02 v1(85.29,10.01) ; v1(25.74,12.5) 25.73,12.5 LED8.1 ; v1(9.94,60.03) 10.23,59.74 U7.3 ; R35.1 v1(8.38,61.03) ; v1(10.67,38.24) 10.72,38.18 U14.41 v1(11.57,37.4) ; v1(27.18,69.86) 27.65,69.86 OPT4.3 ; LED16.1 v1(45.28,12.5) ; R116.1 v1(112.48,77.42) ; U14.41 v1(11.57,36) ; v1(85.34,7.51) 85.33,7.51 LED38.1
  Top Layer w0.35: v1(10.3,51.57) 10.85,52.13 C21.1 ; v1(10.3,51.57) 9.75,52.13 C23.1 ; v1(10.3,51.57) C24.2 ; R12.1 v1(108.63,21.15) ; v1(89.9,43.5) 90.04,43.64 U4.4 ; v1(86.3,50.1) 87.09,50.1 PS1.1 ; C15.1 87.57,46.63 v1(87.53,46.68)
  Top Layer w0.4: C18.2 v1(1.08,24.27) ; C17.1 2.82,23.39 v1(2.8,23.37)
  Top Layer w0.5: R3.1 89.19,34.41 v1(89.21,34.44) ; v1(89.21,39.65) 89.15,39.71 88.42,39.71 ; OPT2.2 v1(102.26,69.23) ; D7.1 108.86,16.26 v1(108.86,16.25) 108.84,16.23 D6.1 ; C25.1 v1(99.71,59.9) ; U13.2 v1(12.32,5.87) ; U1.7 84.29,40.24 C7.1 ; OPT1.2 103.93,64.3 v1(102.26,64.3)
  Top Layer w0.6: C7.1 82.47,41.46 v1(82.45,41.48) ; 99.19,29.95 Q3.3 96.08,29.95 ; v1(96.08,37.68) 97.62,37.68 Q2.3 99.23,37.7 v1(99.25,37.68) ; C2.1 88.22,31.45 ; 88.22,31.45 v1(88.65,31.88) ; 88.22,31.45 88.23,31.45 v1(88.65,31.02)
  vias: v1(13.36,59.24) v1(70.85,20.54) v1(76.2,31.08) v1(77.12,31.08) v1(78.12,31.08) v1(79.17,31.08) v1(96.08,29.95) v1(99.2,29.95)
GND_ISO: length 8.3
  Top Layer w0.26: C14.1 v1(97.35,49.68) ; R20.1 v1(112.25,47.75) ; U5.5 v1(109.96,48.26) ; D5.3 v1(115.25,53.75) ; v1(95.8,50.4) 95.6,50.2 PS1.4 ; C9.1 v1(97.5,53.45) ; U4.5 96.65,44.09 v1(96.75,44) ; R10.1 v1(99.25,54.75) ; Q4.2 v1(103.1,46.75)
  Top Layer w0.4: 108.95,54.25 v1(108.25,54.25)
VBUS: length 23.8
  Top Layer w0.26: 4.39,57.12 4.13,56.86 4.13,54.67 5.06,53.74 6.92,53.74 7.37,54.19 C23.2 9.36,54.19 9.9,53.65 C24.1 10.3,54.42 11.32,55.44 11.32,56.56 11.51,56.75 11.85,56.75 11.86,56.74 ; 4.39,57.12 5.35,57.12 5.71,56.77 6.16,56.77 USB1.11 ; 4.39,57.12 3.88,57.63 3.88,60.49 4.49,61.1 5.51,61.1 5.76,61.35 USB1.2 6.88,61.35 7.58,62.04 D11.2
VIN: length 28.5
  Top Layer w1.7: Q1.4 97.58,21.33 99.93,18.98 109.86,18.98 114.63,23.75 TB1.1
A_DIR: length 25.1
  Top Layer w0.26: U10.2 53.04,19.9 52.2,19.06 52.2,9.56 52.46,9.3 54.16,9.3 54.33,9.12 54.33,8.75 R61.2 55.77,8.75 57.02,7.5 ; 57.02,7.5 J12.3
A_ENABLE: length 13.3
  Top Layer w0.26: U10.3 60.6,19.26 58.5,19.26 58,18.76 J12.5 57.1,12.5 55.85,13.75 R59.2
A_STEP: length 29
  Top Layer w0.26: U10.1 52.93,20.55 51.61,19.23 v1(51.61,10.68) ; R60.2 54.4,11.31 56.69,11.31 J12.4
  Bottom Layer w0.26: v1(51.61,10.68) 57.32,10.68 J12.4
B_DIR: length 18.2
  Top Layer w0.26: J15.3 66.75,8.75 R68.2 64.34,9.13 64.14,9.33 62.54,9.33 62.51,9.35 62.16,9.35 61.98,9.53 61.98,12.07 60.69,13.36 60.68,13.36 58.95,15.1 58.95,15.1 58.8,15.25 58.8,17.22 59.54,17.95 U10.5
B_ENABLE: length 14
  Top Layer w0.26: J15.5 66.78,13.72 64.36,13.72 R66.2 64.32,13.77 64.32,14.3 64.13,14.49 62.36,14.49 61.59,13.72 60.83,13.72 59.31,15.25 59.31,17.03 59.58,17.3 U10.6
B_STEP: length 22
  Top Layer w0.26: U10.4 59.1,18.6 58.42,17.92 58.42,14.23 61.34,11.31 v1(61.34,10.68) ; R67.2 66.75,11.25 J15.4
  Bottom Layer w0.26: J15.4 67.32,10.68 v1(61.34,10.68)
C_DIR: length 25
  Top Layer w0.26: 86.21,19.9 84.87,19.9 v1(84.64,20.13) ; R77.2 76.75,8.75 J17.3 79.3,8.8 79.3,13.56 78.6,14.26 v1(78.6,19.59)
  Bottom Layer w0.26: v1(78.6,19.59) 79.14,20.13 v1(84.64,20.13)
C_ENABLE: length 14.4
  Top Layer w0.26: R75.2 v1(75.05,13.75) ; U11.1 78.57,20.55 78,19.98 J17.5
  Bottom Layer w0.26: J17.5 76.75,13.75 v1(75.05,13.75)
C_STEP: length 24.4
  Top Layer w0.26: 76.45,11.27 76.45,14.46 75.68,15.24 62.95,15.24 61.54,16.65 U10.7 ; 76.45,11.27 76.43,11.25 R76.2 ; 76.45,11.27 76.45,10.89 77.34,10 J17.4
CS_SD: length 51.5
  Top Layer w0.26: v1(18.36,73.56) 18.36,66.74 20.5,64.6 20.5,49.51 23.75,46.26 23.75,33.41 23.39,33.06 U14.17 ; SD1.2 v1(15,73.56)
  Bottom Layer w0.26: v1(15,73.56) v1(18.36,73.56)
DTR: length 61
  Top Layer w0.26: 35.43,36.15 35.43,39.12 36.48,40.18 ; v1(37.9,36.15) 37.9,34.39 R28.1 ; Q6.2 36.45,59.44 35.94,59.95 31.88,59.95 30.9,60.93 v1(30.9,65.28) ; 11.86,61.74 v1(11.86,65.28)
  Bottom Layer w0.26: v1(30.9,65.28) 30.9,65.28 v1(11.86,65.28) ; v1(35.43,36.15) v1(37.9,36.15)
ESP32_EN: length 45.3
  Top Layer w0.26: v1(33.52,33.93) 34.44,33.93 Q5.3 34.45,32.7 34.94,32.21 37.86,32.21 39.48,33.84 ; 39.48,33.84 SW1.2 ; 39.48,33.84 39.48,32.57 39.92,32.13 39.92,31.5 R30.1 ; U14.3 v1(4.14,29.98)
  Bottom Layer w0.26: v1(4.14,29.98) 4.14,31.71 5.72,33.28 26.42,33.28 27.06,33.93 v1(33.52,33.93) 33.52,33.93
EXP_RXD: length 116.1
  Top Layer w0.26: R26.1 106.77,16.2 106.51,16.46 96.45,16.46 87.6,25.3 85.17,25.3 v1(82.66,27.81) ; v1(28.58,46.06) 28.58,27.57 29.08,27.06 69.97,27.06 v1(70.02,27.1) ; U14.28 v1(16.84,45.09)
  Bottom Layer w0.26: v1(82.66,27.81) 81.95,27.1 v1(70.02,27.1) ; v1(28.58,46.06) 19.89,46.06 18.92,45.09 v1(16.84,45.09)
GPIO_0: length 130
  Top Layer w0.26: 29.46,39.14 29.58,39.25 v1(33.4,39.25) 34.43,39.25 Q6.3 ; 29.46,39.14 v1(29.46,46.63) ; 29.46,39.14 29.46,28.33 29.97,27.82 70.15,27.82 v1(70.95,28.63) ; U14.27 v1(18.92,46.25) ; v1(83.79,27.94) 83.8,27.94 85.96,25.78 87.98,25.78 96.6,17.15 R27.1 ; v1(40.51,39.25) 39.64,39.25 SW2.2 39.49,37.43 39.87,37.06 R32.1
  Bottom Layer w0.26: v1(18.92,46.25) 19.4,46.73 29.37,46.73 v1(29.46,46.63) ; v1(33.4,39.25) v1(40.51,39.25) ; v1(70.95,28.63) 71.41,29.09 82.68,29.09 83.79,27.98 v1(83.79,27.94)
GPIO_3: length 102.5
  Top Layer w0.26: v1(48.26,59.32) 51.94,63 81.78,63 84.58,65.79 86.9,65.79 87.63,66.53 87.63,66.63 R96.1 88.64,67.78 R95.1 87.44,68.58 OPT12.4 ; v1(35.56,59.32) 28.32,59.32 25.19,56.19 25.19,31.2 24.5,30.52 U14.15
  Bottom Layer w0.26: v1(35.56,59.32) v1(48.26,59.32)
GPIO_4: length 178.1
  Top Layer w0.26: v1(46.99,34.3) v1(46.99,43.84) 46.99,44.46 65.02,62.49 81.91,62.49 84.71,65.29 87.12,65.29 v1(89.92,68.08) ; v1(95.12,68.08) 95.12,76.81 95.63,77.32 99.23,77.32 R5.1 99.26,78.57 R119.2 ; U14.4 5.46,28.8 v1(5.46,29.98) ; R11.1 91.92,41.57 90.68,42.81 88.77,42.81 86.11,45.47 62.48,45.47 60.83,43.82 v1(53.59,43.82)
  Bottom Layer w0.26: v1(89.92,68.08) v1(95.12,68.08) ; v1(5.46,29.98) 5.46,31.38 6.86,32.77 35.69,32.77 36.7,33.79 46.48,33.79 v1(46.99,34.3) ; v1(53.59,43.82) 53.58,43.84 v1(46.99,43.84)
GPIO_5: length 178.9
  Top Layer w0.26: R118.2 98.74,76.4 99.11,76.02 R8.1 99.1,75.38 97.87,75.38 95.88,73.39 v1(95.88,67.32) ; v1(90.3,67.32) 89.67,67.32 87.02,64.67 84.85,64.67 82.17,61.98 65.15,61.98 47.88,44.71 v1(47.88,43.06) v1(47.88,33.66) ; U14.5 v1(6.69,29.98) ; v1(52.58,43.19) 61.21,43.19 62.87,44.84 85.72,44.84 88.26,42.3 90.67,42.3 91.77,41.2 91.9,41.2 92.84,40.27 92.84,36.86 R16.1
  Bottom Layer w0.26: v1(47.88,43.06) 52.45,43.06 v1(52.58,43.19) ; v1(90.3,67.32) v1(95.88,67.32) ; v1(6.69,29.98) 6.69,31.33 7.63,32.28 37.09,32.28 38.25,33.43 47.01,33.43 47.24,33.66 v1(47.88,33.66)
GPIO_6: length 114.4
  Top Layer w0.26: v1(92.33,62.62) 99.2,62.62 R48.1 ; v1(83.82,62.49) 82.8,61.48 65.53,61.48 48.77,44.72 48.77,32.91 v1(48.77,32.9) ; U14.6 v1(7.95,29.98)
  Bottom Layer w0.26: v1(48.77,32.9) 38.99,32.9 37.8,31.71 8.67,31.71 7.95,30.99 v1(7.95,29.98) ; v1(92.33,62.62) 92.2,62.49 v1(83.82,62.49)
GPIO_7: length 116.9
  Top Layer w0.26: v1(88.65,65.29) 87.67,64.31 85.51,64.31 84.41,63.21 84.41,61.23 84.15,60.97 65.54,60.97 49.51,44.94 49.51,32.63 v1(48.77,31.89) ; R39.1 100.49,65.32 v1(100.46,65.29) ; v1(9.27,29.85) 9.27,28.8 U14.7
  Bottom Layer w0.26: v1(48.77,31.89) 38.61,31.89 37.89,31.17 9.69,31.17 9.27,30.75 v1(9.27,29.85) ; v1(100.46,65.29) v1(88.65,65.29)
GPIO_8: length 114.3
  Top Layer w0.26: v1(101.21,69.43) 101.21,69.78 R40.1 ; v1(92.07,68.84) 91.06,67.83 91.06,65.92 88.52,63.38 86.61,63.38 85.34,62.11 85.34,60.21 85.08,59.95 65.91,59.95 50.72,44.76 50.72,31.17 v1(50.61,31.06) ; v1(15.62,30.23) 15.62,28.8 U14.12
  Bottom Layer w0.26: v1(15.62,30.23) 49.78,30.23 v1(50.61,31.06) ; v1(101.21,69.43) 100.62,68.84 v1(92.07,68.84)
GPIO_10: length 53
  Top Layer w0.26: U14.18 v1(20.57,34.33) ; J67.6 63.64,23.76 61.87,25.54 27.31,25.54 25.78,27.06 v1(25.78,34.3)
  Bottom Layer w0.26: v1(20.57,34.33) 25.75,34.33 v1(25.78,34.3)
GPIO_13: length 59
  Top Layer w0.26: U14.21 v1(20.7,38.14) ; J67.5 64.03,26.04 27.69,26.04 26.54,27.19 v1(26.54,37.73)
  Bottom Layer w0.26: v1(20.7,38.14) 26.14,38.14 v1(26.54,37.73)
GPIO_14: length 63.8
  Top Layer w0.26: v1(27.69,39.41) 27.69,27.19 28.32,26.55 67.21,26.55 68.85,24.91 J67.4 ; U14.22 v1(20.95,39.41)
  Bottom Layer w0.26: v1(20.95,39.41) v1(27.69,39.41)
GPIO_15: length 56.5
  Top Layer w0.26: U14.8 10.54,28.7 v1(10.54,24.39)
  Bottom Layer w0.26: v1(10.54,24.39) 35.56,24.39 37.59,22.36 59.83,22.36 J67.7
GPIO_36: length 72.3
  Top Layer w0.26: OPT9.4 66.5,68.55 R79.1 67.58,67.76 66.76,66.94 R78.1 66.46,66.4 66.46,66.31 66.13,65.98 66.13,65 65.87,64.74 48.73,64.74 43.38,59.39 v1(43.38,47.51) ; U14.29 v1(15.58,47.51)
  Bottom Layer w0.26: v1(15.58,47.51) 43.38,47.51 v1(43.38,47.51)
GPIO_37: length 66.1
  Top Layer w0.26: 59.82,66.54 59.82,65.98 59.12,65.29 48.01,65.29 42.54,59.83 v1(42.54,48.4) ; U14.30 v1(14.31,47.51) ; 59.94,66.54 R72.1 60.5,67.41 60.5,68.49 R73.1 59.53,68.52 OPT8.4
  Bottom Layer w0.26: v1(42.54,48.4) 42.25,48.1 14.84,48.1 14.31,47.57 v1(14.31,47.51)
GPIO_38: length 60.7
  Top Layer w0.26: v1(41.67,48.89) 41.67,60.1 47.37,65.79 52.83,65.79 53.09,66.05 53.09,66.62 R65.1 53.01,66.77 53.5,67.26 53.5,68.42 R69.1 52.55,68.5 OPT7.4 ; U14.31 v1(13.03,47.51)
  Bottom Layer w0.26: v1(13.03,47.51) 13.03,48.05 13.5,48.51 41.3,48.51 v1(41.67,48.89)
GPIO_39: length 55.2
  Top Layer w0.26: v1(40.77,49.54) 40.77,60.59 46.26,66.08 R62.1 46.78,67.22 46.78,68.57 45.47,68.57 OPT6.4 ; U14.32 v1(11.77,47.51)
  Bottom Layer w0.26: v1(40.77,49.54) 40.24,49.01 12.75,49.01 11.77,48.03 v1(11.77,47.51)
GPIO_40: length 52
  Top Layer w0.26: v1(38.5,49.77) 38.5,66.67 R56.1 39.57,67.79 R57.1 39,68.42 38.18,69.25 OPT5.4 ; U14.33 v1(10.5,47.51)
  Bottom Layer w0.26: v1(38.5,49.77) 38.25,49.51 11.5,49.51 10.5,48.51 v1(10.5,47.51)
GPIO_41: length 40.9
  Top Layer w0.26: v1(22.27,50.3) 22.27,57.71 30.76,66.2 R49.1 30.76,69.21 OPT4.4 31.47,69.25 32.27,68.45 R50.1 ; U14.34 9.25,46.28 v1(9.25,47.51)
  Bottom Layer w0.26: v1(9.25,47.51) 9.25,49.01 10.11,49.87 21.93,49.87 22.27,50.22 v1(22.27,50.3)
GPIO_42: length 39.8
  Top Layer w0.26: v1(21.33,50.5) 21.33,62.23 24.66,65.56 R44.1 24.66,67.76 23.97,68.45 OPT3.4 24.74,69.25 25.54,68.45 R107.1 ; v1(8,47.51) 8,46.3 U14.35
  Bottom Layer w0.26: v1(21.33,50.5) 8.74,50.5 8,49.76 v1(8,47.51)
GPIO_45: length 117.1
  Top Layer w0.26: 19.36,44.48 20.55,44.48 v1(20.57,44.46) ; v1(92.07,65.92) 89.03,62.87 87.12,62.87 85.85,61.6 85.85,59.7 85.59,59.44 65.92,59.44 51.31,44.84 v1(51.31,44.46) ; v1(98.55,65.92) 98.55,72.53 99.06,73.03 111.06,73.03 111.67,73.64 112.29,73.64 113.02,74.37 113.02,74.4 113.05,74.43 113.05,75.66 112.61,76.09 111,76.09 R6.2 111.6,76.79 R116.2
  Bottom Layer w0.26: v1(51.31,44.46) v1(20.57,44.46) ; v1(92.07,65.92) v1(98.55,65.92)
GPIO_46: length 122.7
  Top Layer w0.26: v1(24.51,40.65) 24.51,32.77 23.52,31.79 U14.16 ; R117.2 111.54,74.79 R9.2 110.31,74.06 110.05,73.8 108.58,73.8 108.39,73.61 98.36,73.61 98.04,73.29 98.04,66.86 97.86,66.68 97.55,66.68 97.54,66.69 v1(97.29,66.69) ; v1(50.13,40.78) 50.13,44.94 65.66,60.46 84.58,60.46 84.84,60.72 84.84,62.62 86.09,63.87 88.12,63.87 89.92,65.67 v1(89.92,66.3)
  Bottom Layer w0.26: v1(24.51,40.65) 24.64,40.78 v1(50.13,40.78) ; v1(89.92,66.3) 90.28,66.67 97.27,66.67 v1(97.29,66.69)
GPIO_47: length 88.1
  Top Layer w0.26: v1(45.21,45.47) 45.21,57.54 51.31,63.64 81.38,63.64 81.64,63.9 R94.1 81.64,68.49 81.71,68.56 80.89,68.56 OPT11.4 ; 19.39,41.94 18.06,41.94 v1(18.03,41.92)
  Bottom Layer w0.26: v1(18.03,41.92) 18.03,42.75 20.76,45.47 v1(45.21,45.47)
GPIO_48: length 78.8
  Top Layer w0.26: v1(44.2,43.82) 44.2,58.81 49.53,64.14 73.91,64.14 74.17,64.4 74.17,66.64 R81.1 74.11,67.37 74.5,67.76 74.5,68.49 R82.1 73.45,68.6 OPT10.4 ; U14.25 v1(20.57,43.22)
  Bottom Layer w0.26: v1(44.2,43.82) 33.91,43.82 33.3,43.22 v1(20.57,43.22)
I2S_BCK: length 91
  Top Layer w0.26: v1(68.19,17.31) 66.36,17.31 U10.11 ; v1(11.81,25.15) 11.77,25.2 U14.9 ; v1(87.97,17.31) 87.95,17.3 86.21,17.3 ; v1(37.85,23.12) 37.85,19.06 39.6,17.3 41.2,17.3 41.22,17.32 v1(43.31,17.32) 43.87,17.32 44.48,17.93 R71.2
  Bottom Layer w0.26: v1(43.31,17.32) 43.32,17.31 v1(68.19,17.31) v1(87.97,17.31) ; v1(11.81,25.15) 12.06,24.9 36.07,24.9 v1(37.85,23.12)
I2S_DATA: length 36.4
  Top Layer w0.26: v1(39.24,23.76) 39.24,19.57 39.56,19.25 41.2,19.25 ; U14.10 v1(13.03,25.66)
  Bottom Layer w0.26: v1(13.03,25.66) 13.29,25.41 36.83,25.41 38.48,23.76 v1(39.24,23.76)
I2S_MR#: length 53
  Top Layer w0.26: v1(67.65,16.65) 66.35,16.65 ; 86.21,16.65 v1(87.41,16.65) 88.96,16.65 C30.2 ; 45.01,16.65 v1(42.33,16.65) 41.2,16.65
  Bottom Layer w0.26: v1(67.65,16.65) v1(87.41,16.65) ; v1(42.33,16.65) 67.65,16.65
I2S_WS: length 84.6
  Top Layer w0.26: U10.12 66.37,17.93 v1(67.63,17.93) ; U14.11 14.35,28.7 v1(14.35,26.3) ; v1(87.41,17.93) 86.23,17.93 86.21,17.95 ; v1(42.44,17.93) 42.41,17.95 41.2,17.95 41.17,17.92 40,17.92 38.61,19.31 v1(38.61,24.52)
  Bottom Layer w0.26: v1(87.41,17.93) v1(67.63,17.93) v1(42.44,17.93) ; v1(38.61,24.52) 37.21,25.92 14.73,25.92 v1(14.35,26.3)
MISO: length 49.1
  Top Layer w0.26: SD1.7 13.83,79.01 16.76,79.01 17.02,78.75 17.02,65.03 18.05,64 18.05,51.32 17,50.26 5,50.26 4.14,49.41 U14.38
MOSI: length 42.6
  Top Layer w0.26: 13.78,74.66 14.88,74.66 16,73.54 16,64.65 16.75,63.9 16.75,51.5 15.87,50.62 4.85,50.62 4.48,50.25 4.38,50.25 2.88,48.75 U14.39
RS485_RX: length 87
  Top Layer w0.26: v1(51.94,41.54) 51.94,44.2 54.86,47.13 75.56,47.13 78.61,50.17 84.33,50.17 84.59,49.91 84.59,49.65 84.58,49.64 R114.1 85.15,48.65 91.44,48.65 91.62,48.47 91.62,46.93 91.31,46.62 90.06,46.62 U4.2 ; v1(22.86,41.54) 22.86,36.84 21.62,35.6 U14.19
  Bottom Layer w0.26: v1(51.94,41.54) v1(22.86,41.54)
RS485_TX: length 78.8
  Top Layer w0.26: U14.20 19.42,36.84 21.21,36.84 22.1,37.73 v1(22.1,42.3) ; 84.62,46.46 84.62,47.35 R115.1 ; 84.62,46.46 86.65,46.46 87.87,45.24 89.92,45.24 U4.3 ; 84.62,46.46 62.58,46.46 60.53,44.41 v1(55.37,44.41)
  Bottom Layer w0.26: v1(55.37,44.41) 53.26,42.3 v1(22.1,42.3)
RTS: length 53.1
  Top Layer w0.26: v1(35.29,35.15) 35.52,34.92 36.47,34.92 ; 36.47,34.92 36.47,36.39 38.56,38.49 38.56,39.4 38.18,39.79 ; 36.47,34.92 Q5.2 ; 37.94,39.83 R29.1 37.9,41.23 37.21,41.92 37.21,60.08 36.53,60.76 v1(32.1,60.76) ; v1(14.13,62.74) 13.86,62.47 U7.24
  Bottom Layer w0.26: v1(14.13,62.74) 16.11,60.76 v1(32.1,60.76)
SCK: length 43.2
  Top Layer w0.26: U14.23 20.91,40.67 21.25,41.01 21.25,47.26 20.09,48.42 20.09,64 17.61,66.47 v1(17.61,76.86) ; SD1.5 v1(15,76.86)
  Bottom Layer w0.26: v1(15,76.86) v1(17.61,76.86)
SW_VCC: length 156.8
  Top Layer w0.5: v1(67.46,76.23) 67.46,77.84 67.45,77.85 ; v1(67.46,76.23) v1(74.55,76.23) ; v1(67.46,76.23) 67.41,76.28 v1(60.41,76.28) ; v1(60.41,76.28) 60.41,77.89 R90.1 ; v1(60.41,76.28) v1(53.29,76.28) ; v1(46.27,76.23) 46.27,77.75 46.25,77.77 ; v1(46.27,76.23) 53.24,76.23 v1(53.29,76.28) ; v1(46.27,76.23) v1(39.45,76.23) ; v1(74.55,76.23) v1(81.55,76.23) ; v1(74.55,76.23) 74.55,77.95 R92.1 ; v1(81.55,76.23) 81.55,77.89 ; v1(81.55,76.23) 87.91,76.23 88.44,76.76 88.44,77.85 ; v1(53.29,76.28) 53.29,77.81 R89.1 ; v1(32.65,76.23) 32.65,77.97 R86.1 ; v1(32.65,76.23) 25.82,76.23 25.45,76.6 R85.1 ; v1(32.65,76.23) v1(39.45,76.23) ; v1(39.45,76.23) 39.45,77.82 R87.1 ; PTC1.2 90.37,80.93 89.6,80.93 89.15,80.48 89.15,78.18 88.87,77.9 R98.1
  Top Layer w0.8: J9.1 J11.1 J13.1 J14.1 J16.1 J18.1 J19.1 J20.1 J21.1 J22.1 87.75,87.54 90.47,84.82 90.47,81.34
U0RXD_GPIO_44: length 37.9
  Top Layer w0.26: v1(12.5,62.76) 12.86,62.4 U7.26 ; v1(19.5,63.67) 19.5,50.01 18.5,49.01 7.25,49.01 6.69,48.45 U14.36
  Bottom Layer w0.26: v1(19.5,63.67) 13.41,63.67 v1(12.5,62.76)
U0TDX_GPIO_43: length 36.5
  Top Layer w0.26: U14.37 5.42,49.1 5.25,49.26 5.25,49.52 5.43,49.71 17.69,49.71 18.7,50.72 v1(18.7,62.96) ; U7.25 13.36,63.12 13.57,63.33 14.43,63.33 14.75,63.01 v1(15.25,63.01)
  Bottom Layer w0.26: v1(15.25,63.01) 15.3,62.96 v1(18.7,62.96)
U_DIR: length 25.8
  Top Layer w0.26: 87.97,7.5 J23.3 ; 87.97,7.5 87.17,7.5 85.92,8.75 R101.2 ; 87.97,7.5 86.88,6.41 81.98,6.41 81.38,7.01 81.38,12.56 79.09,14.85 79.09,18.9 79.44,19.25 U11.3
U_ENABLE: length 12.9
  Top Layer w0.26: U11.4 81.52,18.6 82.1,19.19 82.88,19.19 83.48,18.59 83.48,15.29 84.33,14.44 R99.2 85.92,13.75 87.17,12.5 J23.5
U_STEP: length 24.6
  Top Layer w0.26: R100.2 86.77,11.23 J23.4 88.6,10 90.08,11.48 90.08,14.41 89.5,14.99 84.58,14.99 84.19,15.38 84.19,19.65 83.43,20.41 82.55,20.41 82.17,20.03 81.75,20.03 81.68,19.95 80.52,19.95 U11.2
USB_D+: length 32.9
  Top Layer w0.26: 7.49,11 7.49,11.82 7.3,12.01 USB2.6 ; 7.49,11 8.2,11 8.51,11.31 9.13,11.31 9.14,11.3 18.78,11.3 19.56,12.08 19.56,25.92 18.11,27.36 U14.14 ; 7.49,11 6.39,11 USB2.8
USB_D-: length 32.3
  Top Layer w0.26: USB2.7 5.59,11.51 5.33,11.77 5.33,12.25 5.59,12.51 USB2.5 9.1,12.51 9.14,12.47 D24.2 18.55,12.47 18.92,12.84 18.92,24.85 16.84,26.93 U14.13
V_DIR: length 34.6
  Top Layer w0.26: U11.6 82.19,17.3 82.58,16.91 v1(82.58,14.59) ; R104.2 97.16,8.7 97.36,8.9 97.62,8.9 97.81,8.71 97.81,8.7 J24.3 100.5,9 v1(100.5,14.61)
  Bottom Layer w0.26: v1(82.58,14.59) 100.48,14.59 v1(100.5,14.61)
V_ENABLE: length 26.9
  Top Layer w0.26: v1(95.98,13.76) 95.97,13.75 R102.2 ; v1(81.88,15.21) 81.88,16.39 81.62,16.65 U11.7 ; J24.5 99,15.19 v1(98.98,15.21)
  Bottom Layer w0.26: v1(95.98,13.76) 98.04,13.76 98.75,13.05 98.75,12.75 J24.5 ; v1(98.98,15.21) v1(81.88,15.21)
V_STEP: length 26.6
  Top Layer w0.26: v1(82.43,18.54) 81.84,17.95 U11.5 ; 97.6,11.29 97.57,11.25 R103.2 ; 97.6,11.29 98.89,10 J24.4 ; 97.6,11.29 97.6,13.56 v1(91.78,19.39)
  Bottom Layer w0.26: v1(91.78,19.39) 84.88,19.39 84.03,18.54 v1(82.43,18.54)
X_DIR: length 22.7
  Top Layer w0.26: U9.1 33.43,20.55 v1(33.38,20.5) ; R38.2 27.25,8.75 J6.3 31.2,10.2 v1(31.2,20.49)
  Bottom Layer w0.26: v1(31.2,20.49) 31.21,20.5 v1(33.38,20.5)
X_ENABLE: length 18.2
  Top Layer w0.26: R36.2 27.26,13.75 28.5,12.51 J6.5 28.6,12.6 v1(28.6,19.2) ; U9.2 33.65,19.9 v1(32.99,19.24)
  Bottom Layer w0.26: v1(28.6,19.2) 28.64,19.24 v1(32.99,19.24)
X_STEP: length 26.1
  Top Layer w0.26: 41.2,19.9 v1(40.08,19.9) ; v1(29.98,19.9) 29.98,11.48 J6.4 27.25,11.25 R37.2
  Bottom Layer w0.26: v1(29.98,19.9) v1(40.08,19.9)
Y_DIR: length 16.4
  Top Layer w0.26: 36.49,9.01 J8.3 ; 36.49,9.01 36.49,13.09 33.95,15.63 33.95,18.2 34.35,18.6 U9.4 ; 36.49,9.01 36.28,8.8 R43.2
Y_ENABLE: length 12
  Top Layer w0.26: U9.5 37.28,17.95 38,17.23 J8.5 ; v1(34.73,13.74) 34.71,13.75 R41.2
  Bottom Layer w0.26: v1(34.73,13.74) 34.78,13.69 35.52,13.69 36.71,12.5 J8.5
Y_STEP: length 16.2
  Top Layer w0.26: R42.2 35.36,11.28 v1(35.38,11.26) ; U9.3 36.64,19.25 39.13,16.76 39.13,11.13 J8.4
  Bottom Layer w0.26: v1(35.38,11.26) 36.64,10 J8.4
Z_DIR: length 27.9
  Top Layer w0.26: v1(40.85,13.82) 40.85,6.35 40.93,6.28 40.93,6.23 v1(41.3,5.85) ; U9.7 36.5,16.65 36.82,16.33 v1(36.82,13.84) ; J10.3 46.75,8.75 44.18,8.75
  Bottom Layer w0.26: v1(36.82,13.84) 36.85,13.82 v1(40.85,13.82) ; J10.3 46.35,5.85 v1(41.3,5.85)
Z_ENABLE: length 32.5
  Top Layer w0.26: v1(67.83,19.91) 67.82,19.9 U10.15 ; 44.18,13.75 v1(44.9,13.75) ; J10.5 49.93,14.43 v1(49.93,19.9)
  Bottom Layer w0.26: v1(67.83,19.91) 58.25,19.91 58.24,19.9 v1(49.93,19.9) ; J10.5 48,13.45 47.7,13.75 v1(44.9,13.75)
Z_STEP: length 22.9
  Top Layer w0.26: v1(43.57,14.52) 44.96,14.52 45.49,13.99 45.49,13.12 45.86,12.75 45.86,12.71 46.45,12.12 46.45,10.26 46.71,10 J10.4 ; U9.6 37.08,17.3 37.41,16.96 v1(37.41,14.53) ; 44.18,11.25 v1(44.85,11.25)
  Bottom Layer w0.26: v1(37.41,14.53) 41.35,14.53 41.36,14.52 v1(43.57,14.52) ; v1(44.85,11.25) 46.75,11.25 J10.4
$1N12844: length 1.7
  Top Layer w0.35: R3.2 88.42,33.55 87.33,33.55 87.1,33.78 U1.4
$1N12846: length 1.4
  Top Layer w0.3: R4.1 83.72,42.44 83.6,42.55 C7.2
$1N12847: length 3.7
  Top Layer w0.3: 84.38,41.58 84.94,41.58 85.12,41.39 85.7,41.39 C6.2 85.77,40.97 85.58,40.78 85.58,39.34 U1.6
$1N12850: length 3.6
  Top Layer w0.35: 88.42,37.06 88.42,38.85
  Top Layer w0.5: U1.5 87.09,39.32 87.56,38.85 88.42,38.85
$1N12852: length 3
  Top Layer w0.35: C1.2 82.08,36 83.02,35.06 U1.1
$1N12896: length 2.5
  Top Layer w0.26: SW1.1 44.33,33.38 44.33,31.54 R31.2
$1N12898: length 2.5
  Top Layer w0.26: SW2.1 43.86,38.34 44.3,37.9 R33.2
$1N12906: length 8.9
  Top Layer w0.26: U7.5 10.12,58.74 9.83,58.45 D9.2 9.16,58.51 7.9,58.51 7.72,58.7 6.17,58.7 6.1,58.63 5.12,58.63 v1(4.95,58.46) ; 6.17,59.7 5.09,59.7 v1(4.95,59.84)
  Bottom Layer w0.26: v1(4.95,59.84) v1(4.95,58.46)
